# Altium schematic sheet Sheet_1_2023-10-08.schdoc
size 953 x 742 mm
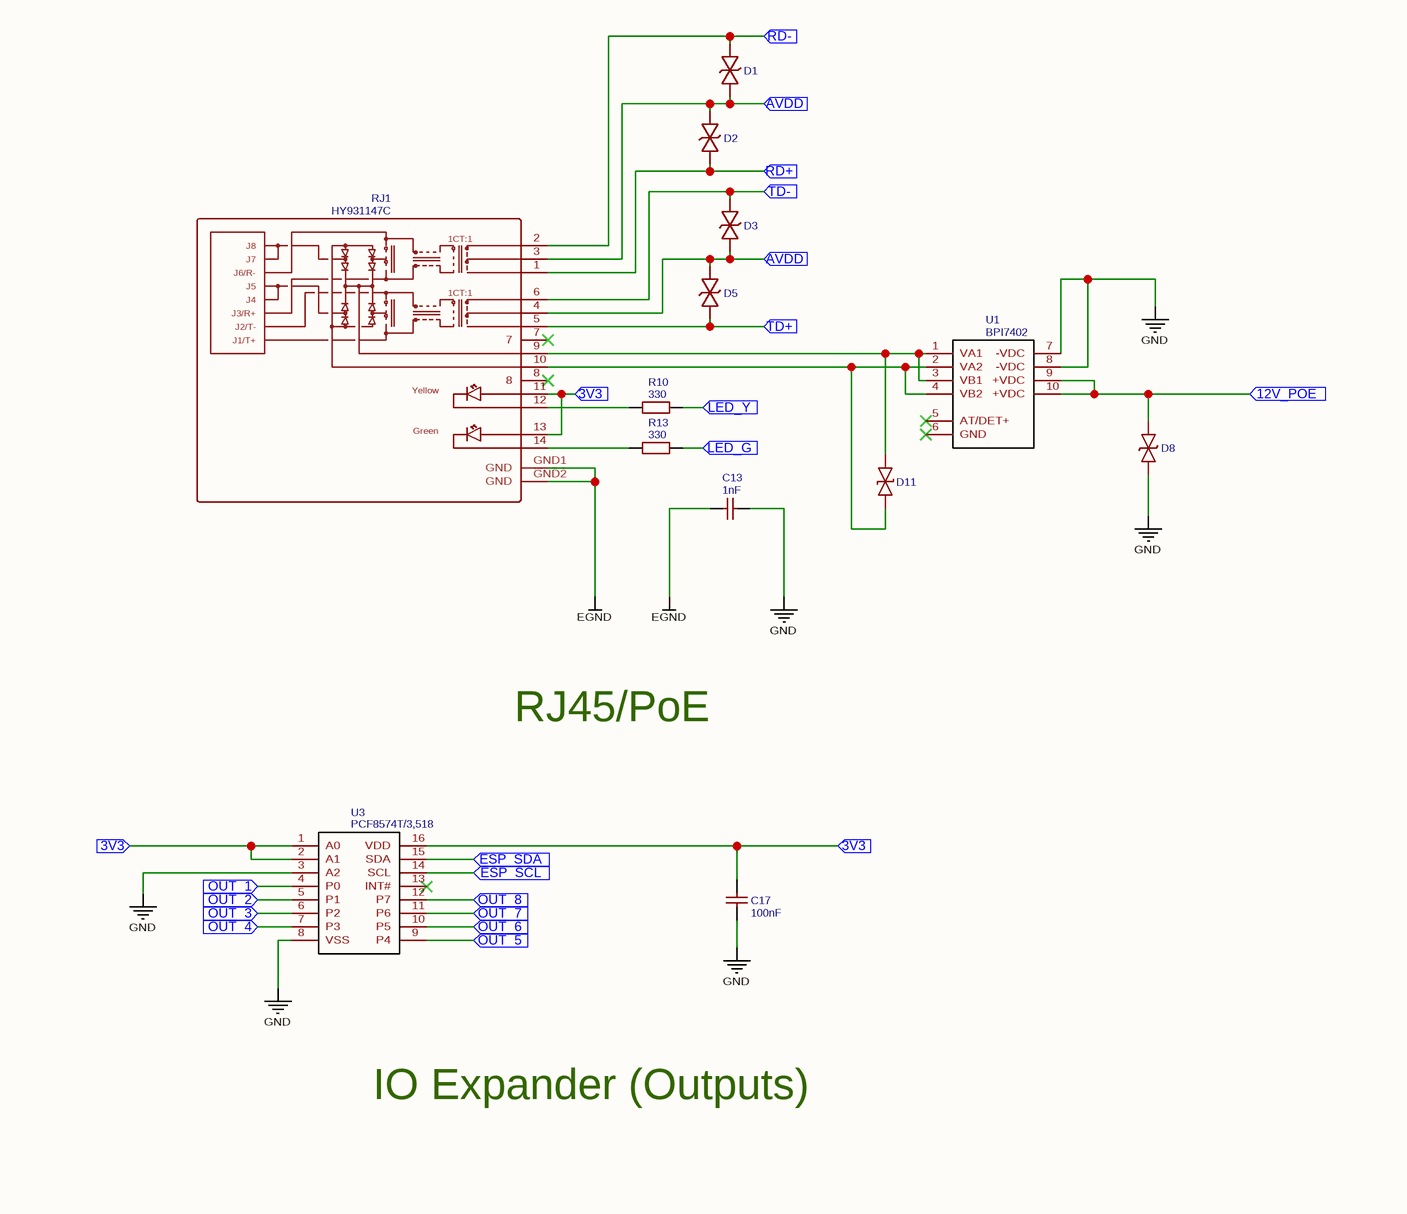
[diagram p0: Sheet_1_2023-10-08.schdoc, top left]
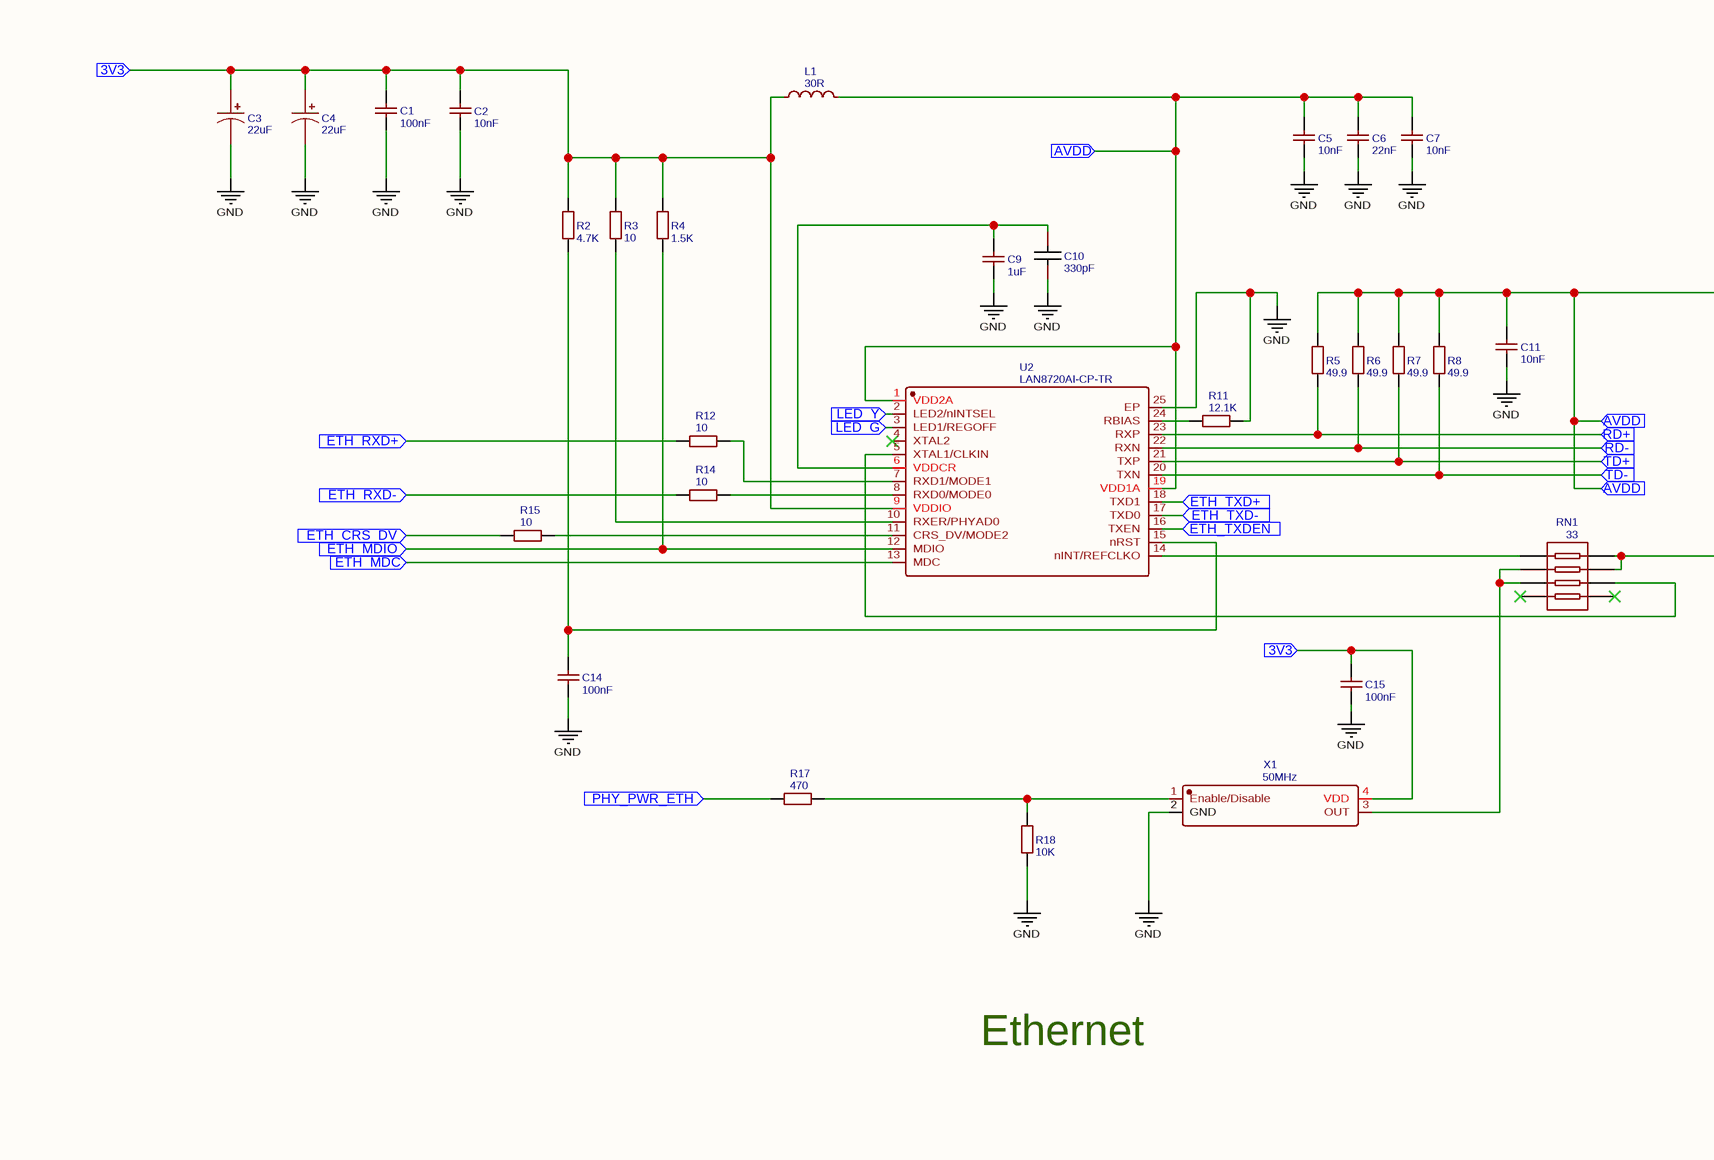
[diagram p1: Sheet_1_2023-10-08.schdoc, top middle]
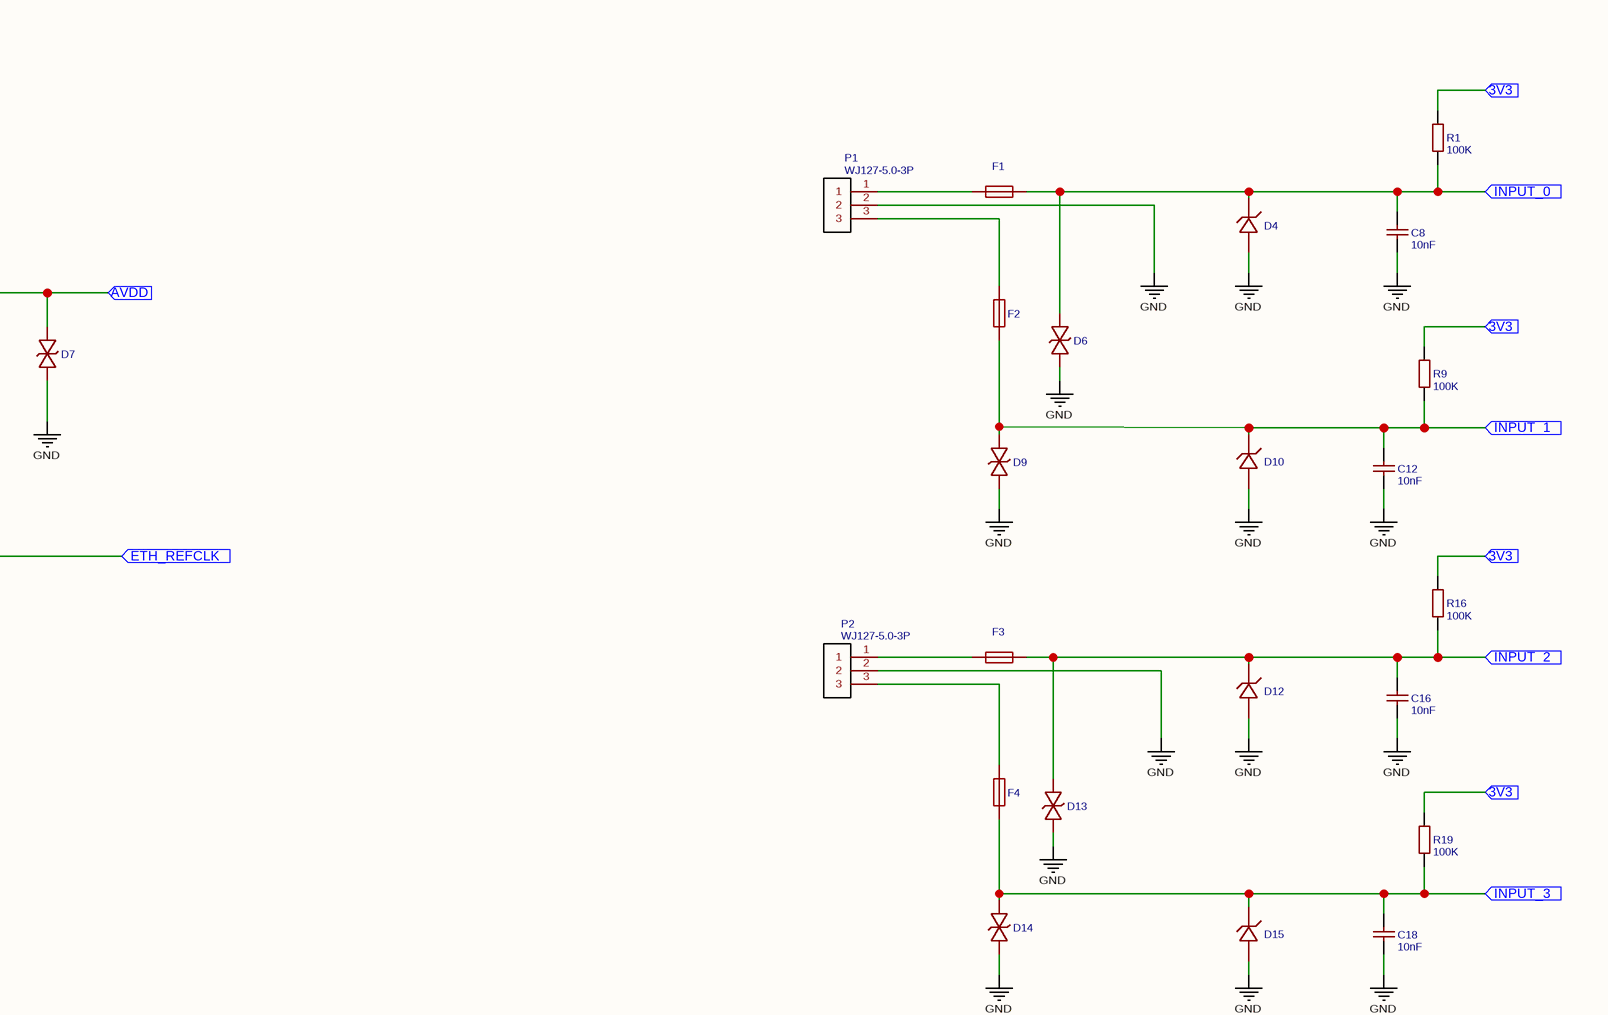
[diagram p2: Sheet_1_2023-10-08.schdoc, top right]
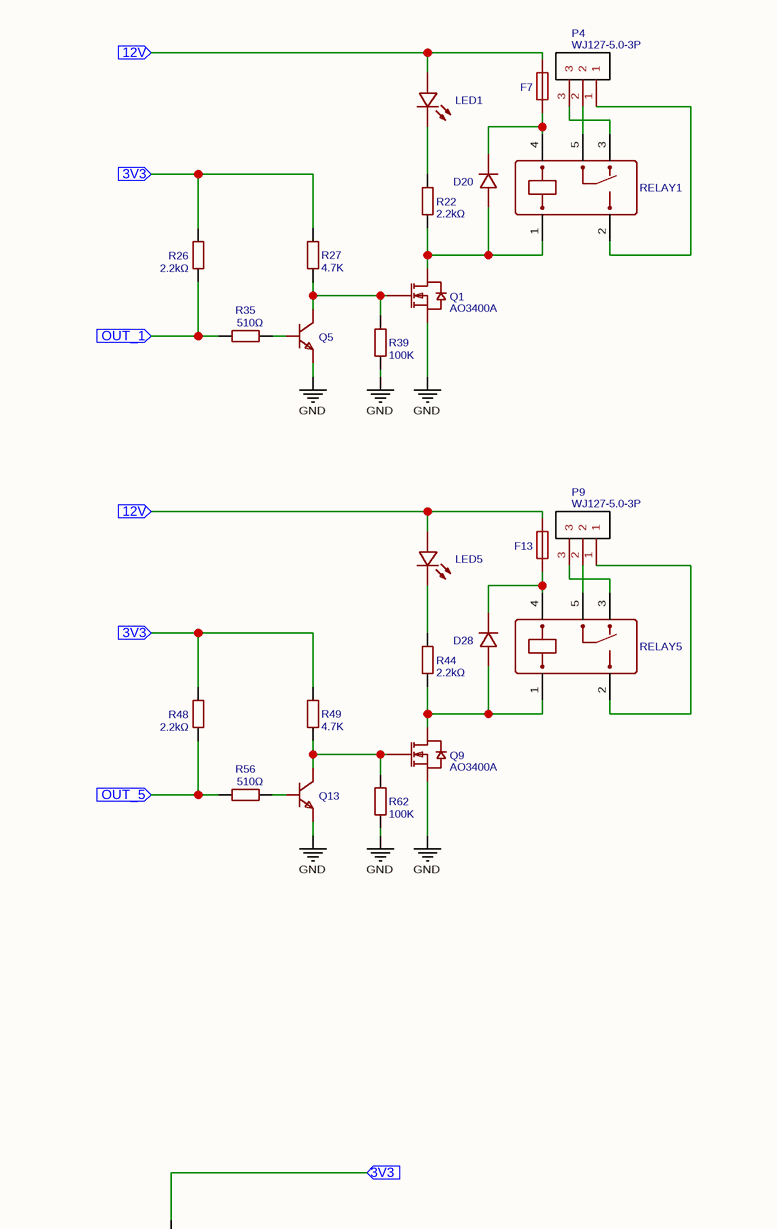
[diagram p3: Sheet_1_2023-10-08.schdoc, centre left]
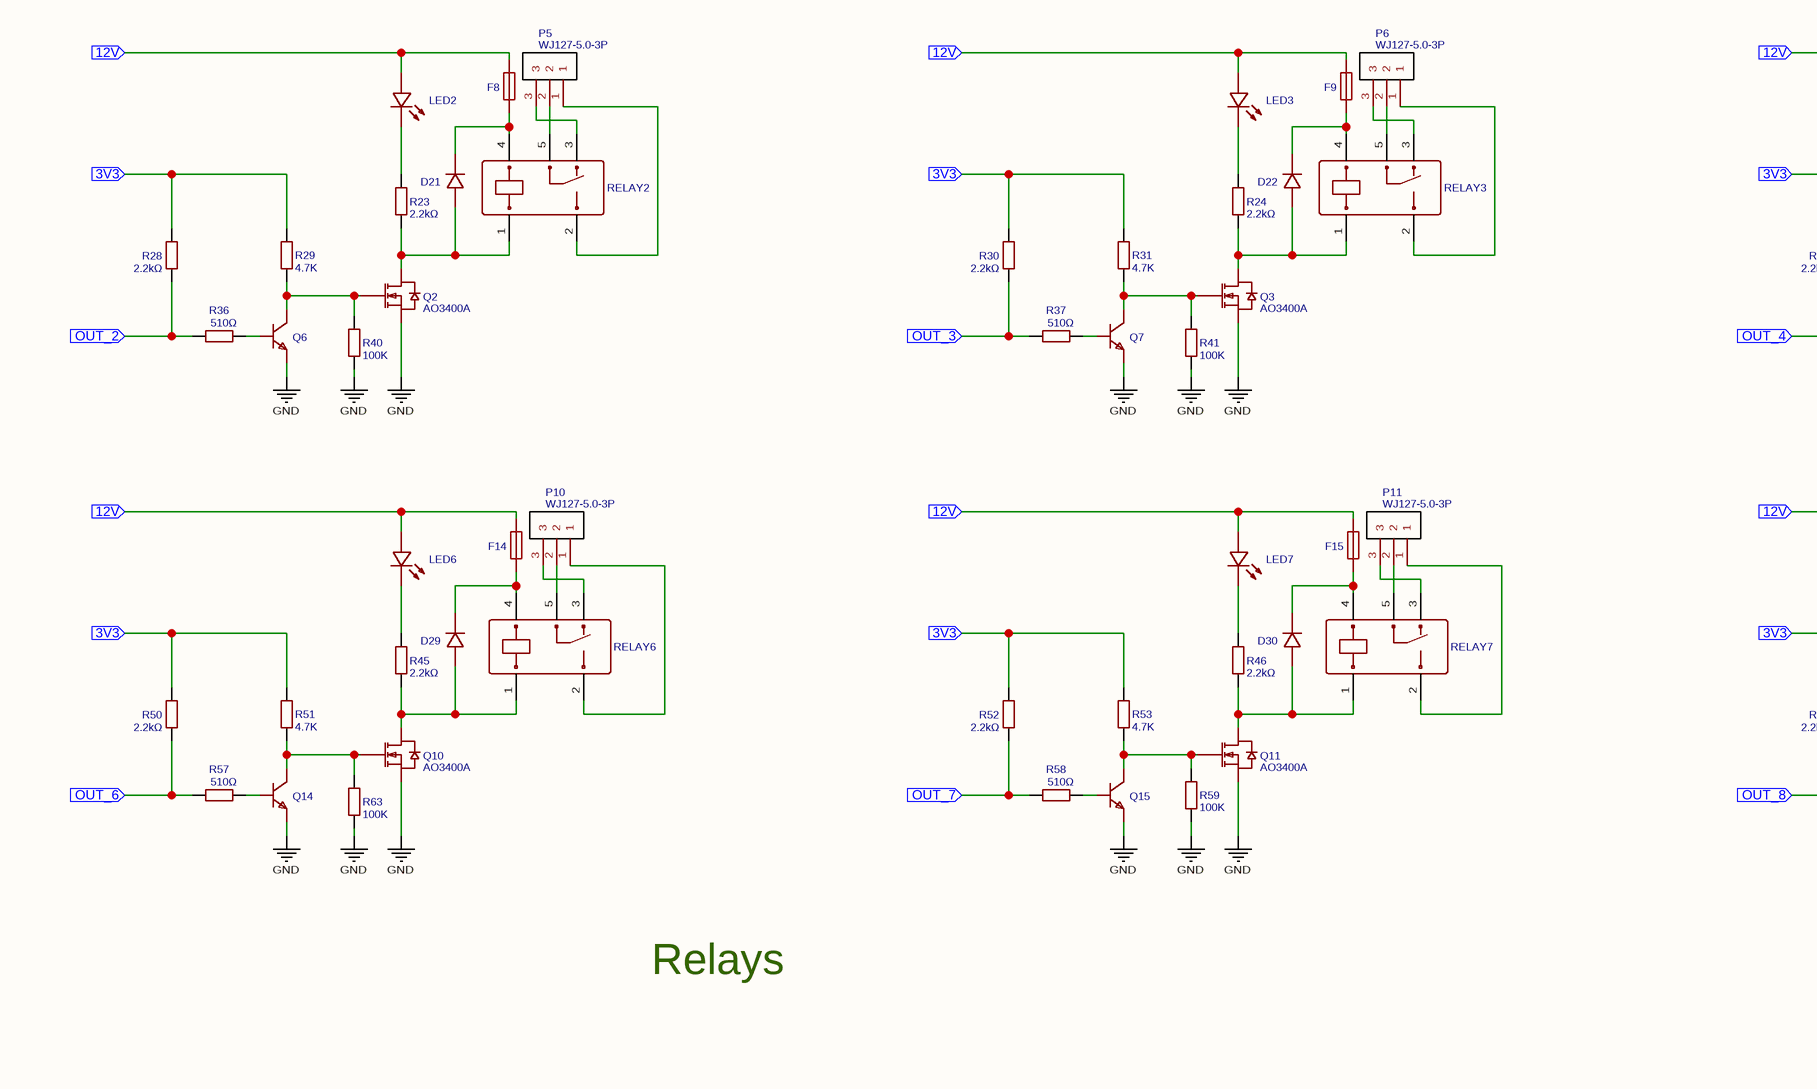
[diagram p4: Sheet_1_2023-10-08.schdoc, centre middle]
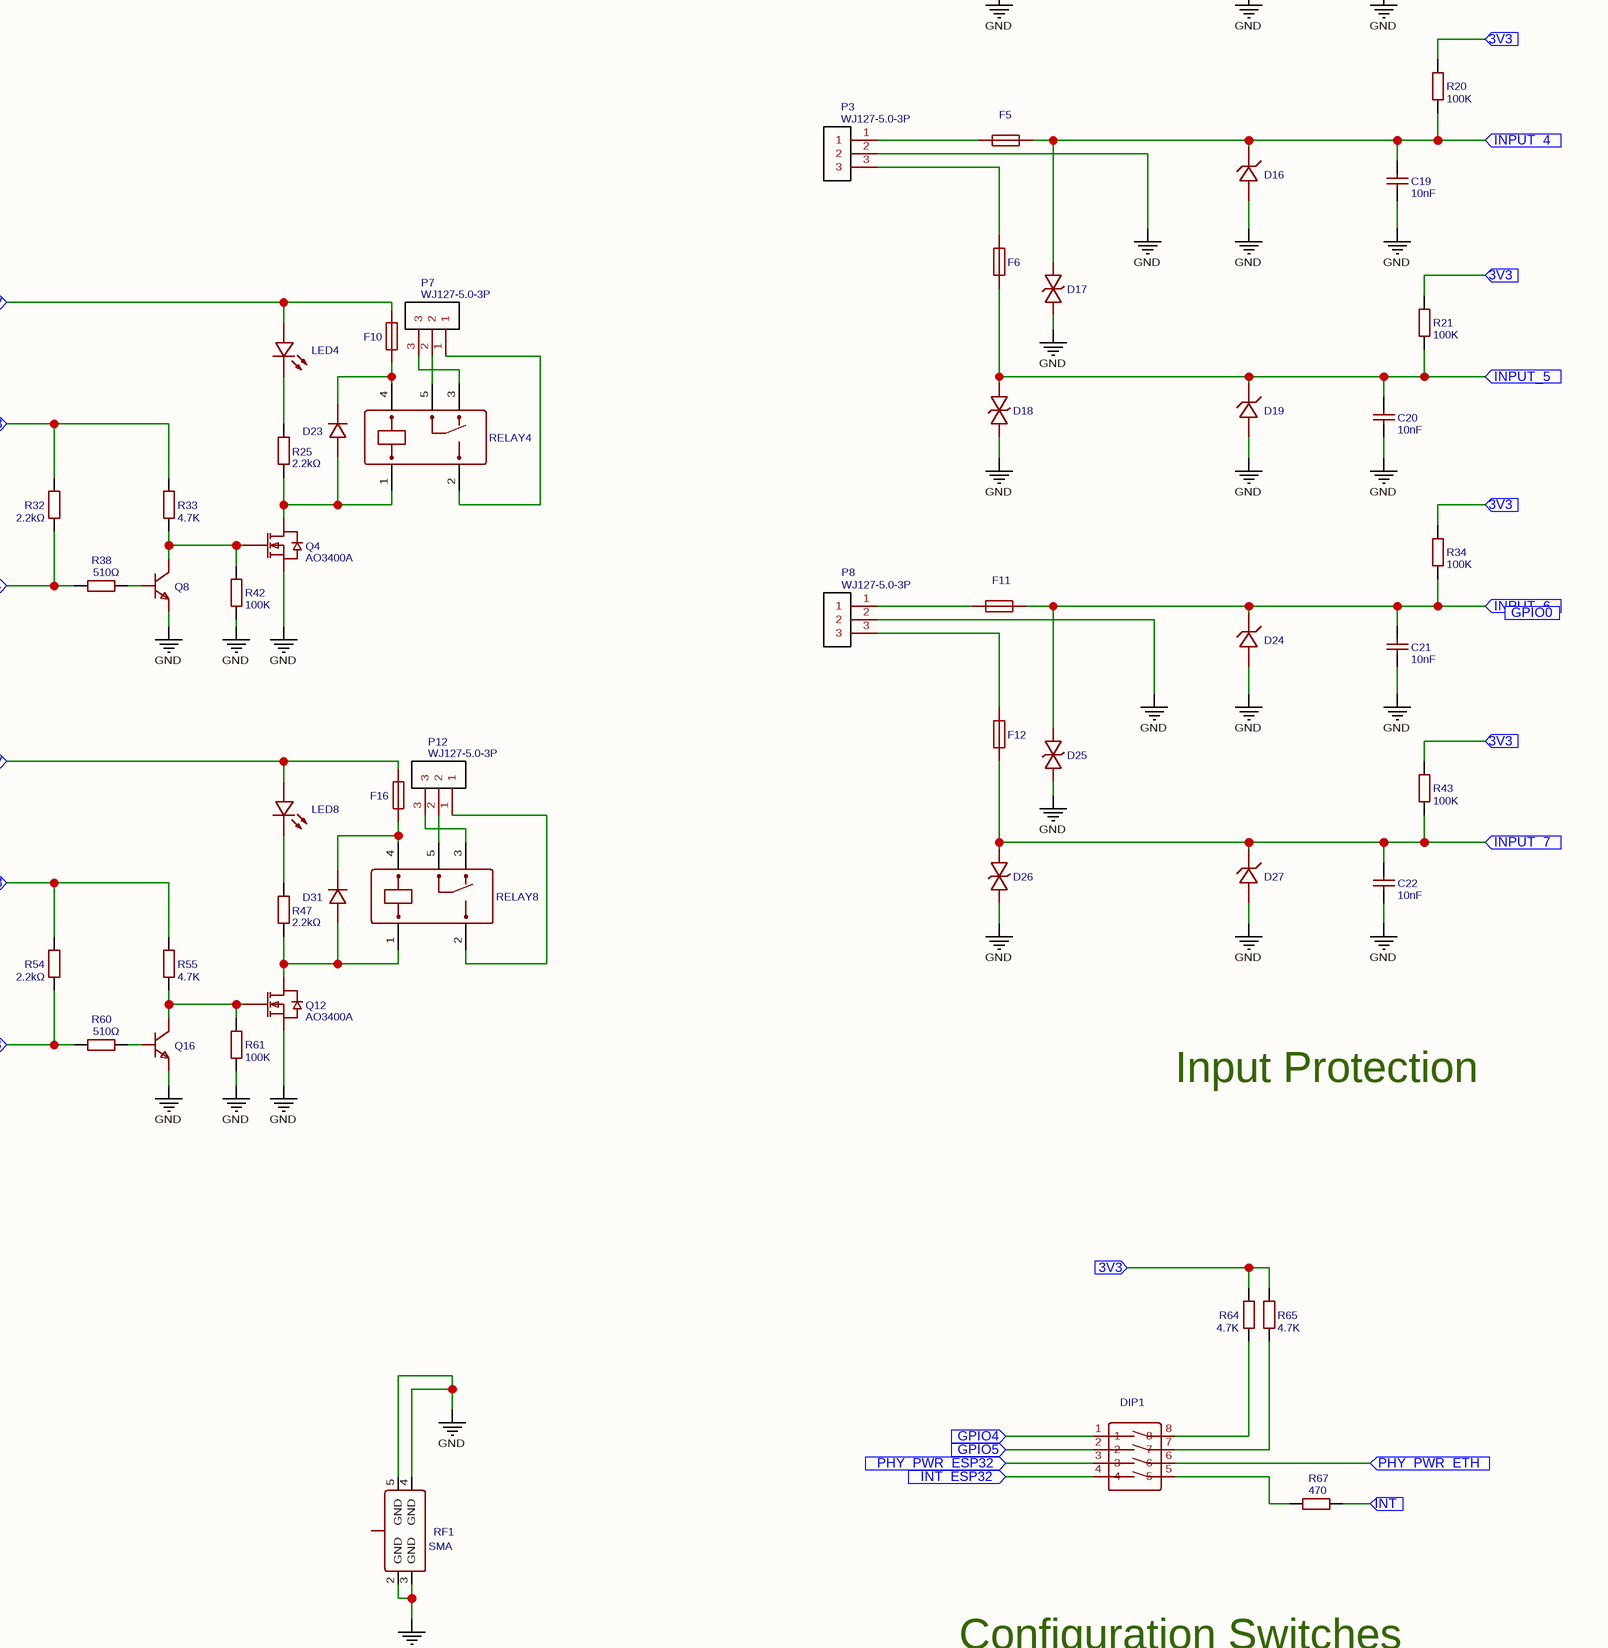
[diagram p5: Sheet_1_2023-10-08.schdoc, centre right]
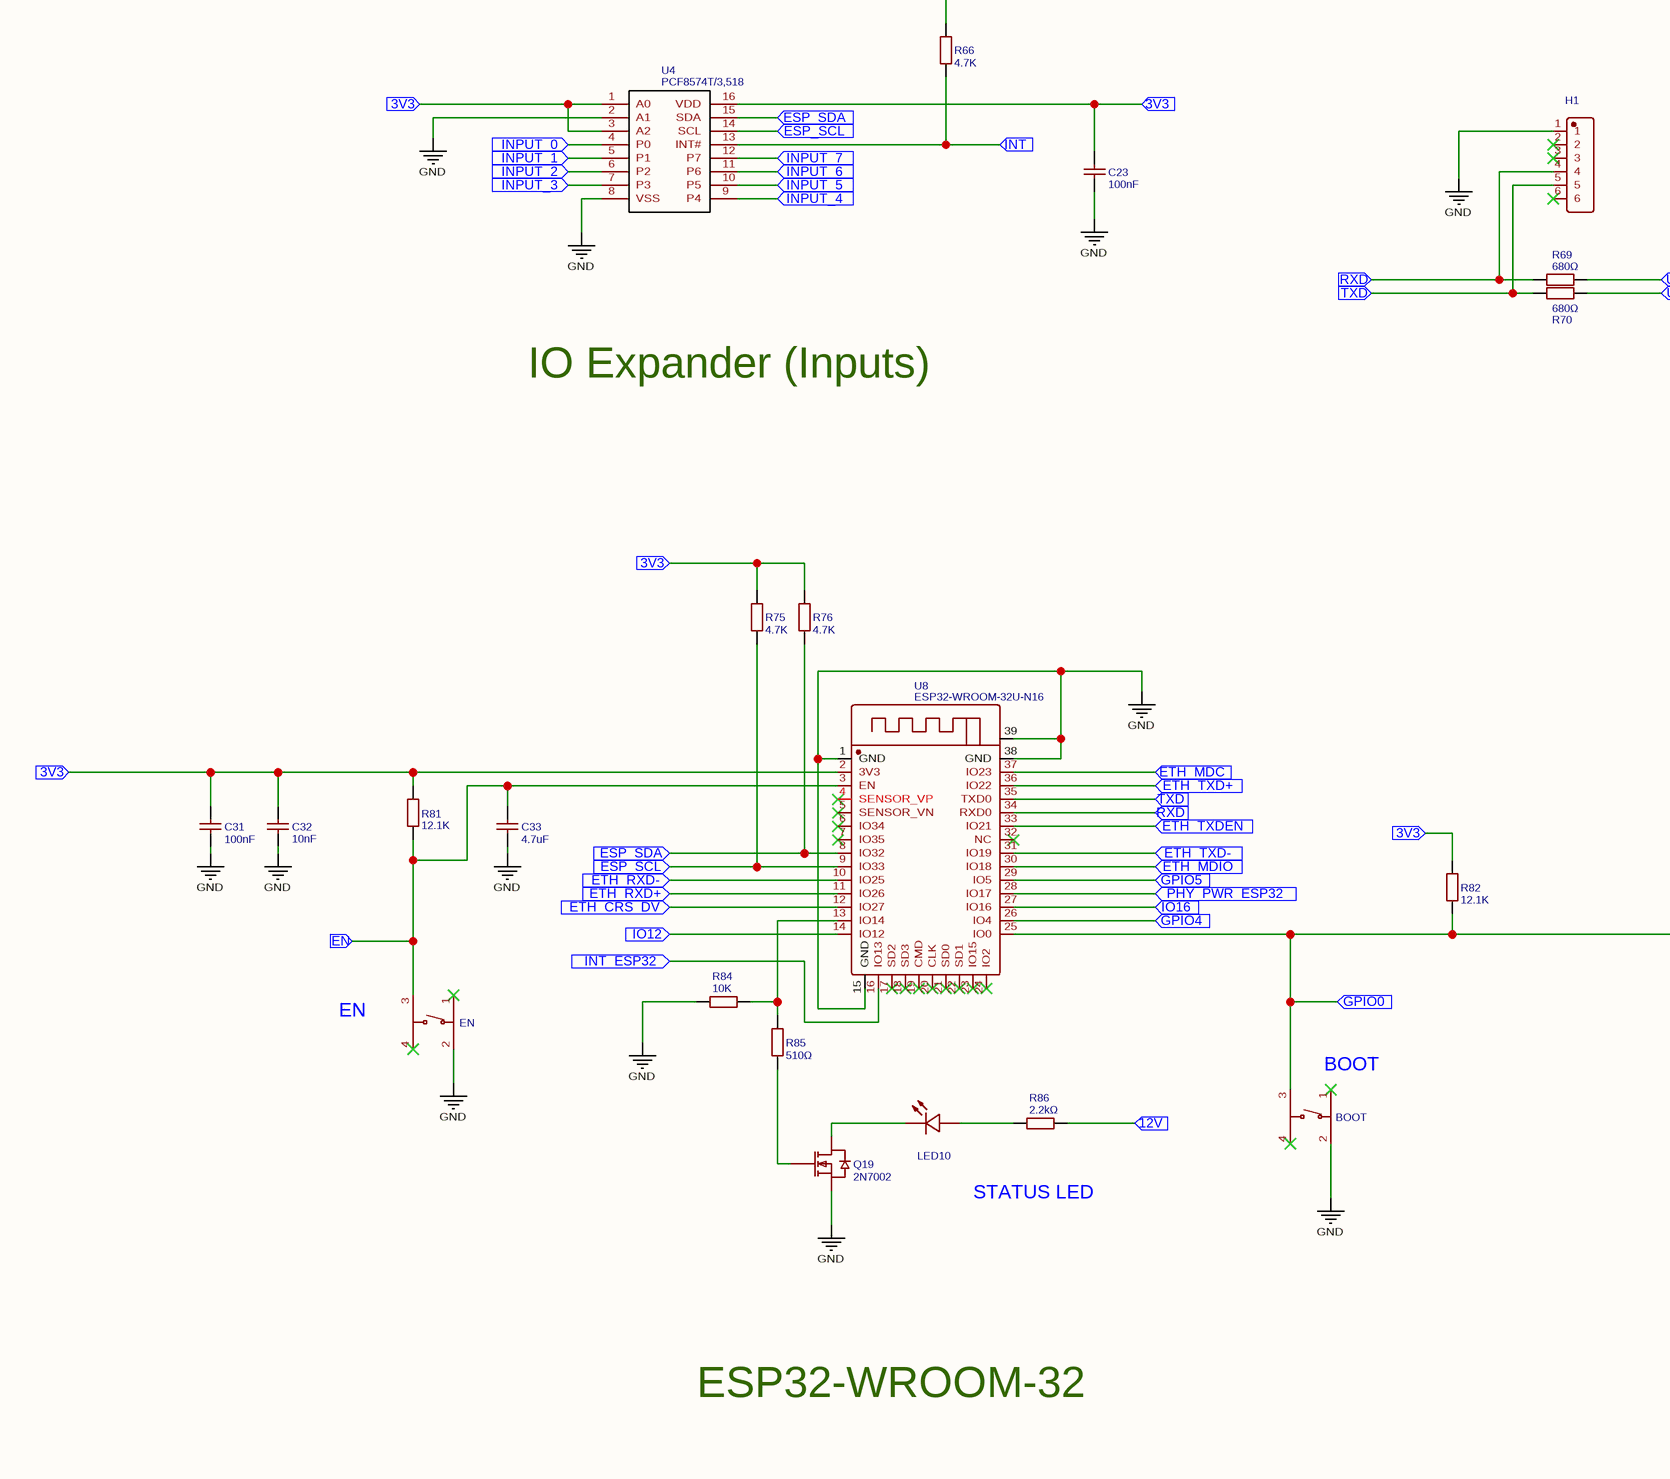
[diagram p6: Sheet_1_2023-10-08.schdoc, bottom left]
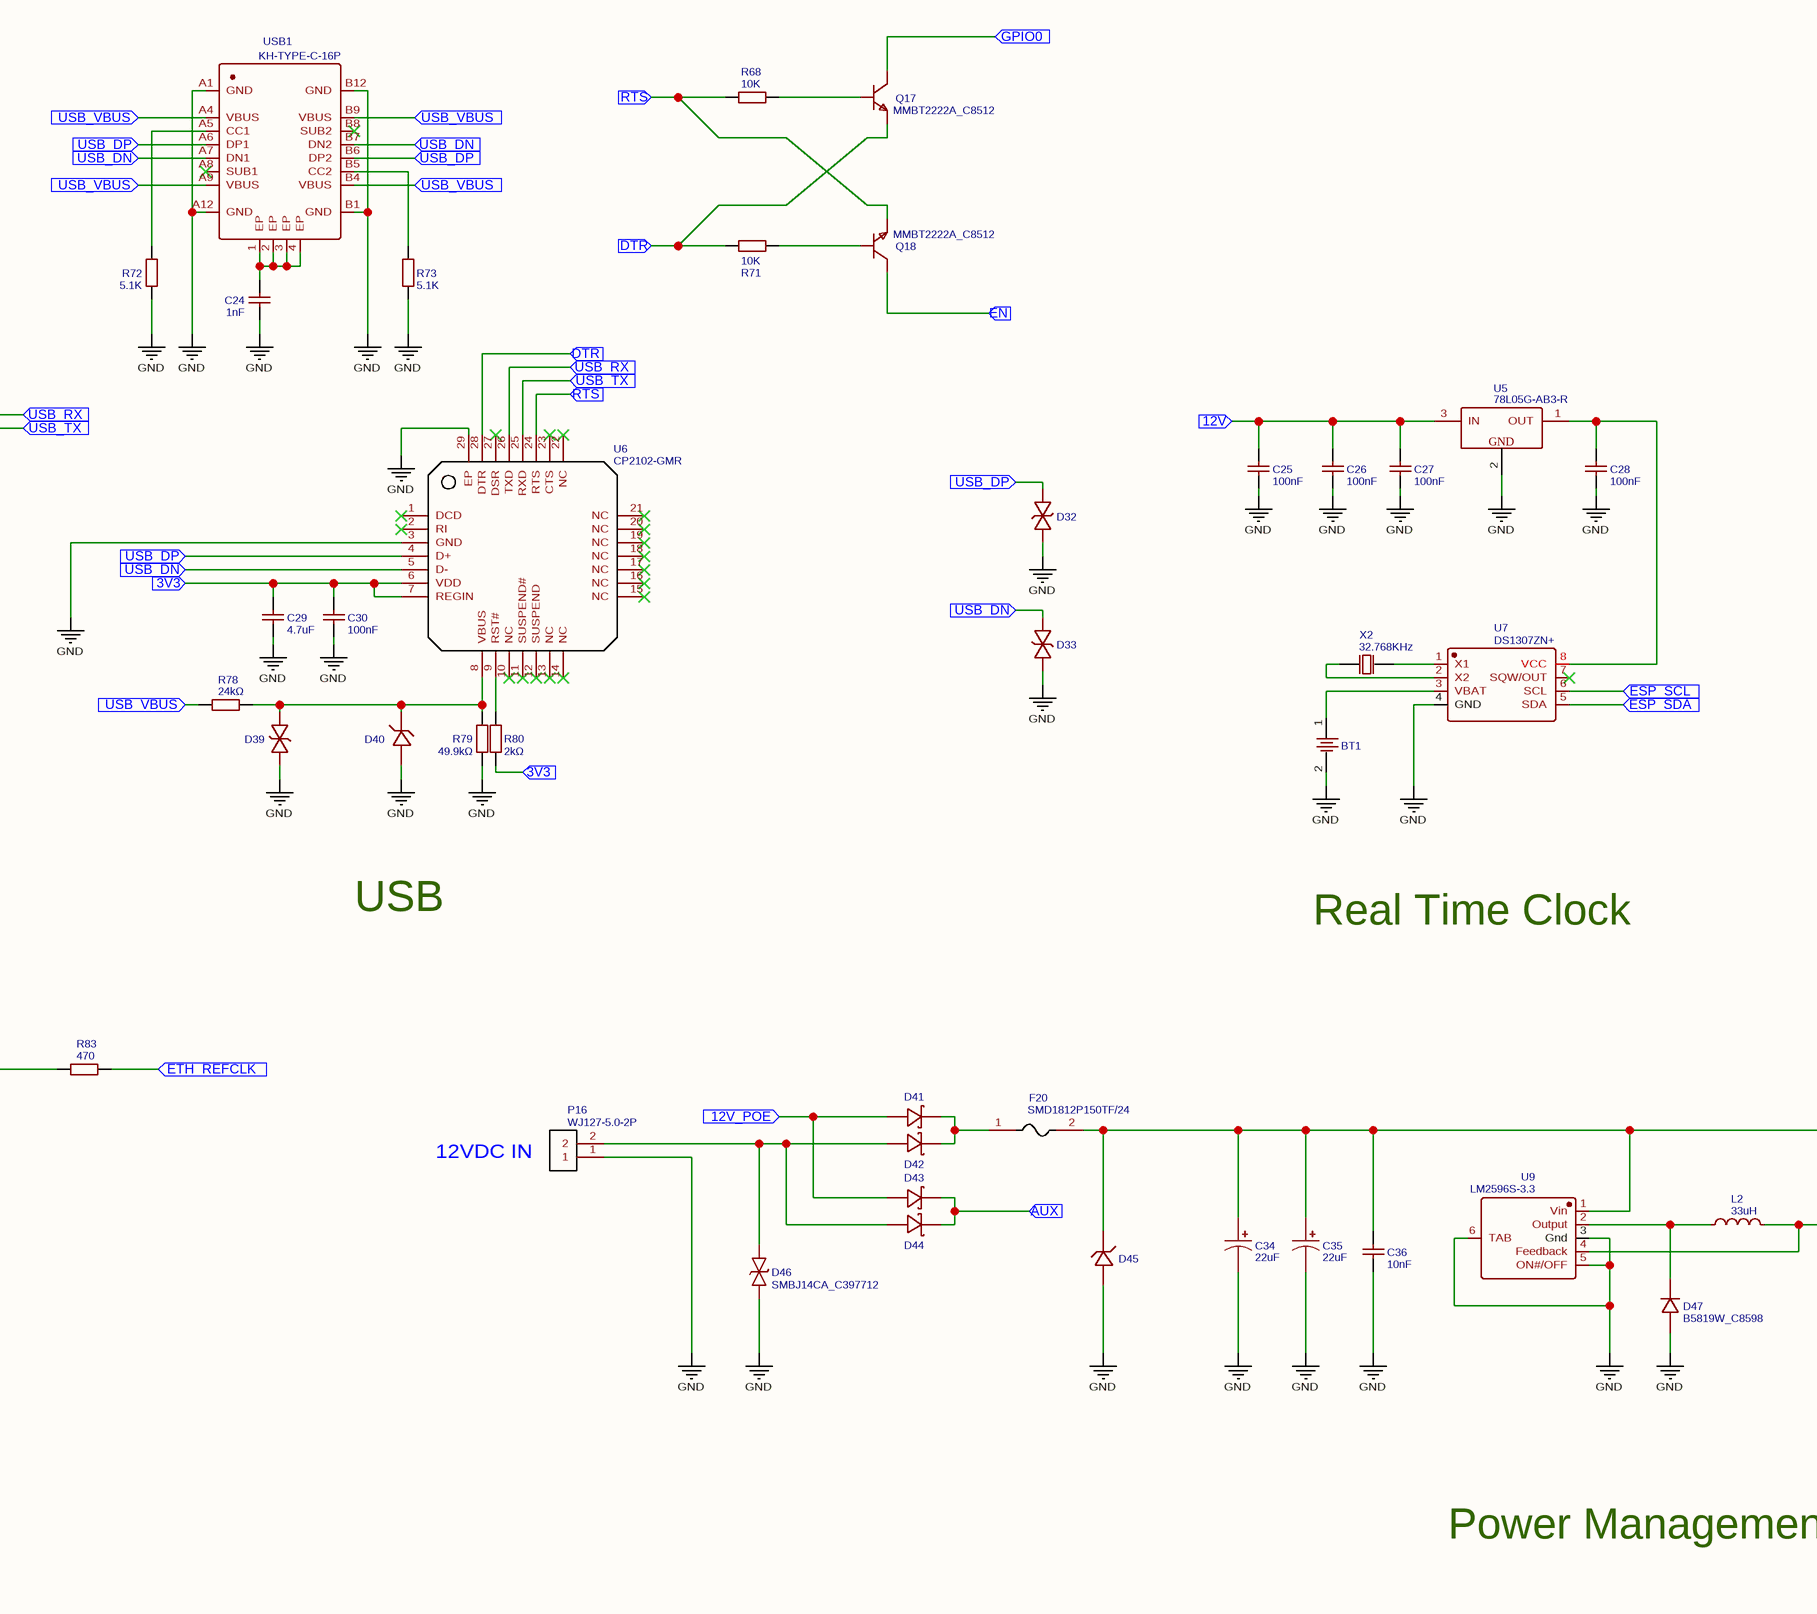
[diagram p7: Sheet_1_2023-10-08.schdoc, bottom middle]
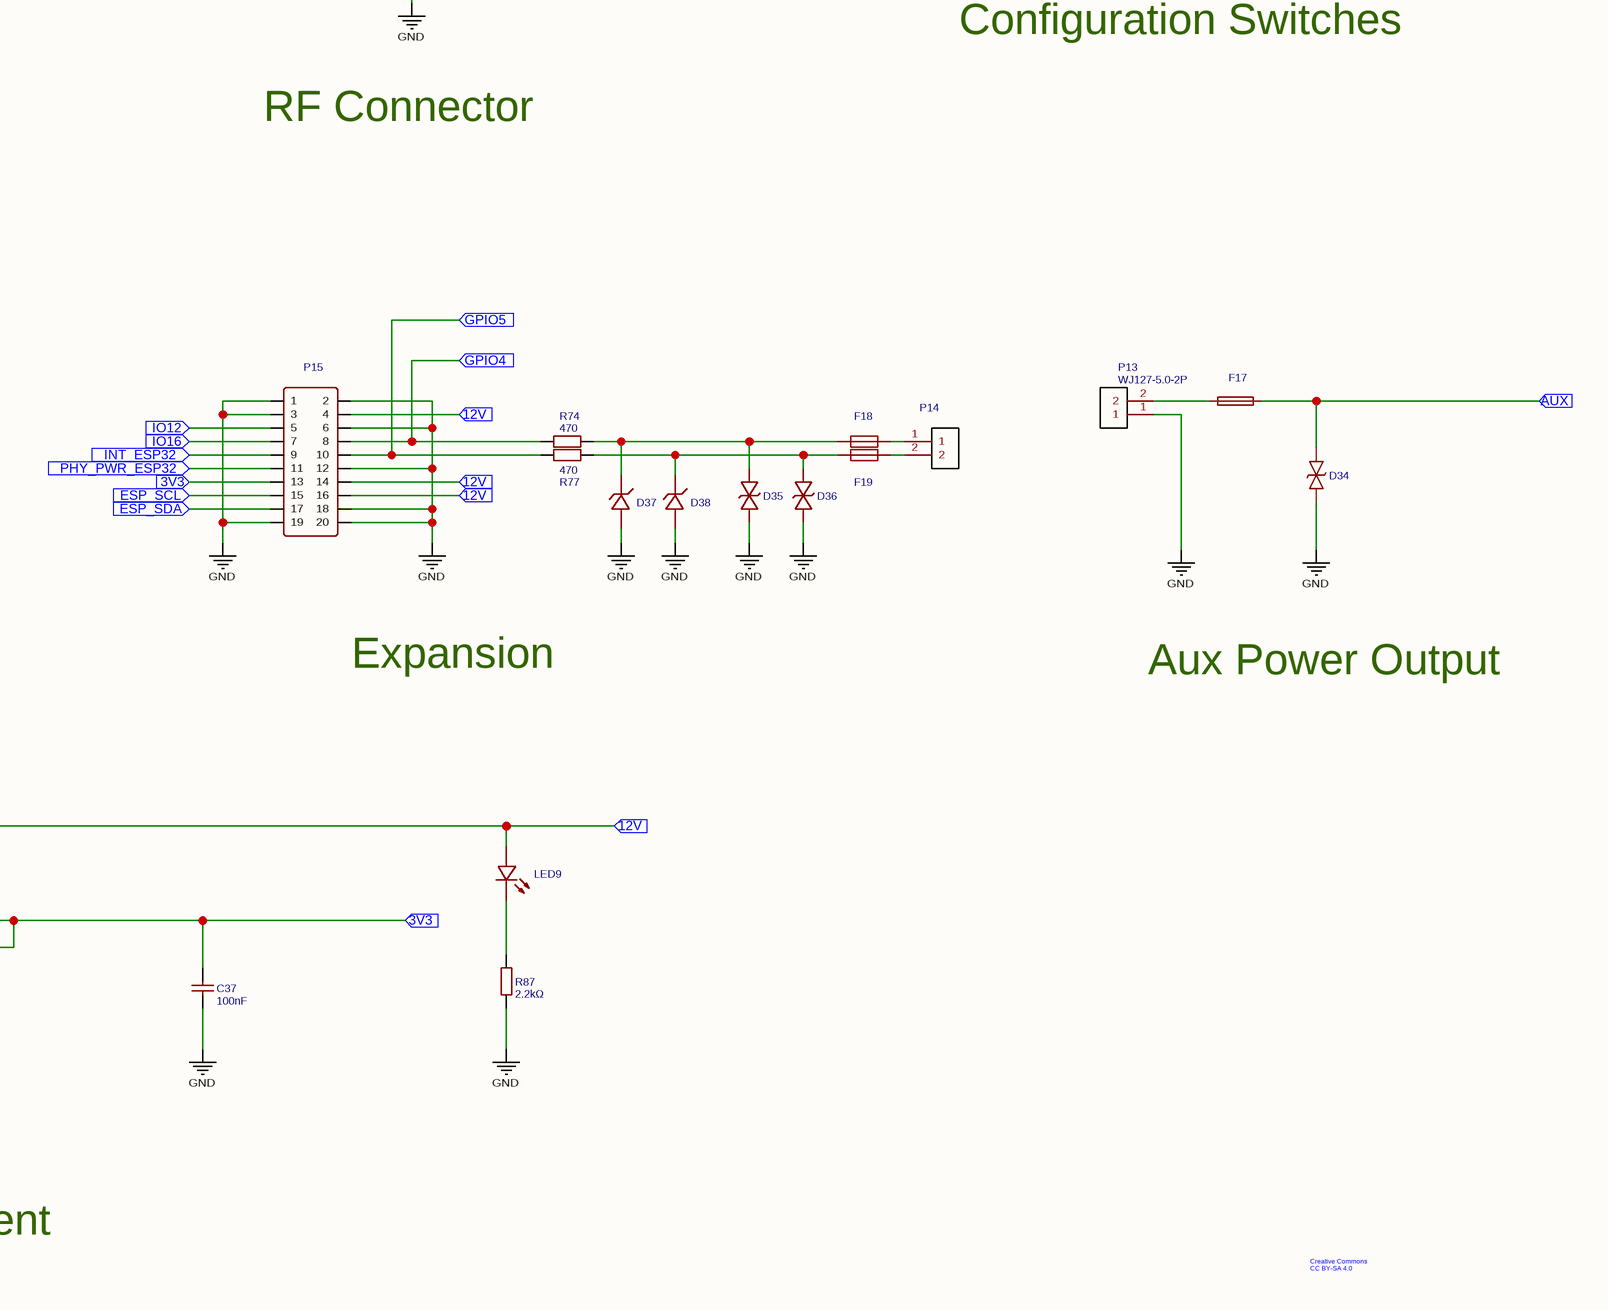
[diagram p8: Sheet_1_2023-10-08.schdoc, bottom right]

## Parts
BOOT  TS-1187A-B-A-B  [SW-SMD_4P-L5.1-W5.1-P3.70-LS6.5-TL-2]  (value not drawn)
BT1  BS-12-A1AJ002-F  [BAT-TH_BS-12-A1AJ002-F]  (value not drawn)
C1  100nF  [C0402_NEW]
C2  10nF  [C0402]
C3  22uF  [CAP-TH_BD5.0-P2.00-D0.8-FD]
C4  22uF  [CAP-TH_BD5.0-P2.00-D0.8-FD]
C5  10nF  [C0402]
C6  22nF  [C0402]
C7  10nF  [C0402]
C8  10nF  [C0402]
C9  1uF  [C0603]
C10  330pF  [C0402]
C11  10nF  [C0402]
C12  10nF  [C0402]
C13  1nF  [C1206]
C14  100nF  [C0402_NEW]
C15  100nF  [C0402_NEW]
C16  10nF  [C0402]
C17  100nF  [C0402_NEW]
C18  10nF  [C0402]
C19  10nF  [C0402]
C20  10nF  [C0402]
C21  10nF  [C0402]
C22  10nF  [C0402]
C23  100nF  [C0402_NEW]
C24  1nF  [C1206]
C25  100nF  [C0402_NEW]
C26  100nF  [C0402_NEW]
C27  100nF  [C0402_NEW]
C28  100nF  [C0402_NEW]
C29  4.7uF  [C1206]
C30  100nF  [C0402_NEW]
C31  100nF  [C0402_NEW]
C32  10nF  [C0402]
C33  4.7uF  [C1206]
C34  22uF  [CAP-TH_BD5.0-P2.00-D0.8-FD]
C35  22uF  [CAP-TH_BD5.0-P2.00-D0.8-FD]
C36  10nF  [C0805]
C37  100nF  [C0402_NEW]
D1  PESD03V32D-LC  [SOD-323_L1.7-W1.3-LS2.5-BI]  (value not drawn)
D2  PESD03V32D-LC  [SOD-323_L1.7-W1.3-LS2.5-BI]  (value not drawn)
D3  PESD03V32D-LC  [SOD-323_L1.7-W1.3-LS2.5-BI]  (value not drawn)
D4  ZMM3V3  [LL-34_L3.5-W1.5-RD]  (value not drawn)
D5  PESD03V32D-LC  [SOD-323_L1.7-W1.3-LS2.5-BI]  (value not drawn)
D6  PESD03V32D-LC  [SOD-323_L1.7-W1.3-LS2.5-BI]  (value not drawn)
D7  PESD03V32D-LC  [SOD-323_L1.7-W1.3-LS2.5-BI]  (value not drawn)
D8  SMBJ14CA_C397712  [SMB_L4.4-W3.6-LS5.4-BI]  (value not drawn)
D9  PESD03V32D-LC  [SOD-323_L1.7-W1.3-LS2.5-BI]  (value not drawn)
D10  ZMM3V3  [LL-34_L3.5-W1.5-RD]  (value not drawn)
D11  SMBJ64CA  [SMB_L4.6-W3.6-LS5.3-BI]  (value not drawn)
D12  ZMM3V3  [LL-34_L3.5-W1.5-RD]  (value not drawn)
D13  PESD03V32D-LC  [SOD-323_L1.7-W1.3-LS2.5-BI]  (value not drawn)
D14  PESD03V32D-LC  [SOD-323_L1.7-W1.3-LS2.5-BI]  (value not drawn)
D15  ZMM3V3  [LL-34_L3.5-W1.5-RD]  (value not drawn)
D16  ZMM3V3  [LL-34_L3.5-W1.5-RD]  (value not drawn)
D17  PESD03V32D-LC  [SOD-323_L1.7-W1.3-LS2.5-BI]  (value not drawn)
D18  PESD03V32D-LC  [SOD-323_L1.7-W1.3-LS2.5-BI]  (value not drawn)
D19  ZMM3V3  [LL-34_L3.5-W1.5-RD]  (value not drawn)
D20  B5819W_C8598  [SOD-123_L2.8-W1.8-LS3.7-RD]  (value not drawn)
D21  B5819W_C8598  [SOD-123_L2.8-W1.8-LS3.7-RD]  (value not drawn)
D22  B5819W_C8598  [SOD-123_L2.8-W1.8-LS3.7-RD]  (value not drawn)
D23  B5819W_C8598  [SOD-123_L2.8-W1.8-LS3.7-RD]  (value not drawn)
D24  ZMM3V3  [LL-34_L3.5-W1.5-RD]  (value not drawn)
D25  PESD03V32D-LC  [SOD-323_L1.7-W1.3-LS2.5-BI]  (value not drawn)
D26  PESD03V32D-LC  [SOD-323_L1.7-W1.3-LS2.5-BI]  (value not drawn)
D27  ZMM3V3  [LL-34_L3.5-W1.5-RD]  (value not drawn)
D28  B5819W_C8598  [SOD-123_L2.8-W1.8-LS3.7-RD]  (value not drawn)
D29  B5819W_C8598  [SOD-123_L2.8-W1.8-LS3.7-RD]  (value not drawn)
D30  B5819W_C8598  [SOD-123_L2.8-W1.8-LS3.7-RD]  (value not drawn)
D31  B5819W_C8598  [SOD-123_L2.8-W1.8-LS3.7-RD]  (value not drawn)
D32  PESD03V32D-LC  [SOD-323_L1.7-W1.3-LS2.5-BI]  (value not drawn)
D33  PESD03V32D-LC  [SOD-323_L1.7-W1.3-LS2.5-BI]  (value not drawn)
D34  SMBJ14CA_C397712  [SMB_L4.4-W3.6-LS5.4-BI]  (value not drawn)
D35  PESD03V32D-LC  [SOD-323_L1.7-W1.3-LS2.5-BI]  (value not drawn)
D36  PESD03V32D-LC  [SOD-323_L1.7-W1.3-LS2.5-BI]  (value not drawn)
D37  ZMM3V3  [LL-34_L3.5-W1.5-RD]  (value not drawn)
D38  ZMM3V3  [LL-34_L3.5-W1.5-RD]  (value not drawn)
D39  PESD03V32D-LC  [SOD-323_L1.7-W1.3-LS2.5-BI]  (value not drawn)
D40  ZMM3V3  [LL-34_L3.5-W1.5-RD]  (value not drawn)
D41  SS34_C8678  [DO-214AC_L4.3-W2.7-LS5.3-RD]  (value not drawn)
D42  SS34_C8678  [DO-214AC_L4.3-W2.7-LS5.3-RD]  (value not drawn)
D43  SS34_C8678  [DO-214AC_L4.3-W2.7-LS5.3-RD]  (value not drawn)
D44  SS34_C8678  [DO-214AC_L4.3-W2.7-LS5.3-RD]  (value not drawn)
D45  2EZ13D5_C388131  [DO-41_BD2.4-L4.7-P8.70-D0.9-RD]  (value not drawn)
D46  SMBJ14CA_C397712  [SMB_L4.4-W3.6-LS5.4-BI]
D47  B5819W_C8598  [SOD-123_L2.8-W1.8-LS3.7-RD]
DIP1  DSIC04LHGET  [SW-TH_DSIC04LHGET]  (value not drawn)
EN  TS-1187A-B-A-B  [SW-SMD_4P-L5.1-W5.1-P3.70-LS6.5-TL-2]  (value not drawn)
F1  BSMD0603-002-60V  [F0603]  (value not drawn)
F2  BSMD0603-002-60V  [F0603]  (value not drawn)
F3  BSMD0603-002-60V  [F0603]  (value not drawn)
F4  BSMD0603-002-60V  [F0603]  (value not drawn)
F5  BSMD0603-002-60V  [F0603]  (value not drawn)
F6  BSMD0603-002-60V  [F0603]  (value not drawn)
F7  BSMD0603-025-16V  [F0603]  (value not drawn)
F8  BSMD0603-025-16V  [F0603]  (value not drawn)
F9  BSMD0603-025-16V  [F0603]  (value not drawn)
F10  BSMD0603-025-16V  [F0603]  (value not drawn)
F11  BSMD0603-002-60V  [F0603]  (value not drawn)
F12  BSMD0603-002-60V  [F0603]  (value not drawn)
F13  BSMD0603-025-16V  [F0603]  (value not drawn)
F14  BSMD0603-025-16V  [F0603]  (value not drawn)
F15  BSMD0603-025-16V  [F0603]  (value not drawn)
F16  BSMD0603-025-16V  [F0603]  (value not drawn)
F17  ASMD2920-075  [F2920]  (value not drawn)
F18  BSMD0603-002-60V  [F0603]  (value not drawn)
F19  BSMD0603-002-60V  [F0603]  (value not drawn)
F20  SMD1812P150TF/24  [F1812]
H1  PZ254-1-06-Z-8.5  [HDR-TH_06P-P2.54-V-M]  (value not drawn)
L1  30R  [L0805]
L2  33uH  [IND-TH_BD9.0-P3.50-D0.6_VL0810]
LED1  0603White light_C2290  [LED0603-R-RD_WHITE]  (value not drawn)
LED2  0603White light_C2290  [LED0603-R-RD_WHITE]  (value not drawn)
LED3  0603White light_C2290  [LED0603-R-RD_WHITE]  (value not drawn)
LED4  0603White light_C2290  [LED0603-R-RD_WHITE]  (value not drawn)
LED5  0603White light_C2290  [LED0603-R-RD_WHITE]  (value not drawn)
LED6  0603White light_C2290  [LED0603-R-RD_WHITE]  (value not drawn)
LED7  0603White light_C2290  [LED0603-R-RD_WHITE]  (value not drawn)
LED8  0603White light_C2290  [LED0603-R-RD_WHITE]  (value not drawn)
LED9  0603White light_C2290  [LED0603-R-RD_WHITE]  (value not drawn)
LED10  0603White light_C2290  [LED0603-R-RD_WHITE]  (value not drawn)
P1  WJ127-5.0-3P  [CONN-TH_3P-P5.00_WJ127-5.0-3P]
P2  WJ127-5.0-3P  [CONN-TH_3P-P5.00_WJ127-5.0-3P]
P3  WJ127-5.0-3P  [CONN-TH_3P-P5.00_WJ127-5.0-3P]
P4  WJ127-5.0-3P  [CONN-TH_3P-P5.00_WJ127-5.0-3P]
P5  WJ127-5.0-3P  [CONN-TH_3P-P5.00_WJ127-5.0-3P]
P6  WJ127-5.0-3P  [CONN-TH_3P-P5.00_WJ127-5.0-3P]
P7  WJ127-5.0-3P  [CONN-TH_3P-P5.00_WJ127-5.0-3P]
P8  WJ127-5.0-3P  [CONN-TH_3P-P5.00_WJ127-5.0-3P]
P9  WJ127-5.0-3P  [CONN-TH_3P-P5.00_WJ127-5.0-3P]
P10  WJ127-5.0-3P  [CONN-TH_3P-P5.00_WJ127-5.0-3P]
P11  WJ127-5.0-3P  [CONN-TH_3P-P5.00_WJ127-5.0-3P]
P12  WJ127-5.0-3P  [CONN-TH_3P-P5.00_WJ127-5.0-3P]
P13  WJ127-5.0-2P  [CONN-TH_2P-P5.00_CPC3703CTR]
P14  WJ127-5.0-2P  [CONN-TH_2P-P5.00_CPC3703CTR]  (value not drawn)
P15  Header-Female-2.54_2x10  [HDR-TH_20P-P2.54-V-R2-C10-S2.54]  (value not drawn)
P16  WJ127-5.0-2P  [CONN-TH_2P-P5.00_CPC3703CTR]
Q1  AO3400A  [SOT-23-3_L2.9-W1.6-P1.90-LS2.8-BR]
Q2  AO3400A  [SOT-23-3_L2.9-W1.6-P1.90-LS2.8-BR]
Q3  AO3400A  [SOT-23-3_L2.9-W1.6-P1.90-LS2.8-BR]
Q4  AO3400A  [SOT-23-3_L2.9-W1.6-P1.90-LS2.8-BR]
Q5  2N3904  [SOT-23-3_L2.9-W1.3-P1.90-LS2.4-BR]  (value not drawn)
Q6  2N3904  [SOT-23-3_L2.9-W1.3-P1.90-LS2.4-BR]  (value not drawn)
Q7  2N3904  [SOT-23-3_L2.9-W1.3-P1.90-LS2.4-BR]  (value not drawn)
Q8  2N3904  [SOT-23-3_L2.9-W1.3-P1.90-LS2.4-BR]  (value not drawn)
Q9  AO3400A  [SOT-23-3_L2.9-W1.6-P1.90-LS2.8-BR]
Q10  AO3400A  [SOT-23-3_L2.9-W1.6-P1.90-LS2.8-BR]
Q11  AO3400A  [SOT-23-3_L2.9-W1.6-P1.90-LS2.8-BR]
Q12  AO3400A  [SOT-23-3_L2.9-W1.6-P1.90-LS2.8-BR]
Q13  2N3904  [SOT-23-3_L2.9-W1.3-P1.90-LS2.4-BR]  (value not drawn)
Q14  2N3904  [SOT-23-3_L2.9-W1.3-P1.90-LS2.4-BR]  (value not drawn)
Q15  2N3904  [SOT-23-3_L2.9-W1.3-P1.90-LS2.4-BR]  (value not drawn)
Q16  2N3904  [SOT-23-3_L2.9-W1.3-P1.90-LS2.4-BR]  (value not drawn)
Q17  MMBT2222A_C8512  [SOT-23-3_L2.9-W1.3-P1.90-LS2.4-BR]
Q18  MMBT2222A_C8512  [SOT-23-3_L2.9-W1.3-P1.90-LS2.4-BR]
Q19  2N7002  [SOT-23-3_L2.9-W1.3-P1.90-LS2.4-BR]
R1  100K  [R0402]
R2  4.7K  [R0402]
R3  10  [R0402]
R4  1.5K  [R0402]
R5  49.9  [R0402]
R6  49.9  [R0402]
R7  49.9  [R0402]
R8  49.9  [R0402]
R9  100K  [R0402]
R10  330  [R0402]
R11  12.1K  [R0402]
R12  10  [R0402]
R13  330  [R0402]
R14  10  [R0402]
R15  10  [R0402]
R16  100K  [R0402]
R17  470  [R0402]
R18  10K  [R0402]
R19  100K  [R0402]
R20  100K  [R0402]
R21  100K  [R0402]
R22  2.2kΩ  [R0603]
R23  2.2kΩ  [R0603]
R24  2.2kΩ  [R0603]
R25  2.2kΩ  [R0603]
R26  2.2kΩ  [R0402]
R27  4.7K  [R0402]
R28  2.2kΩ  [R0402]
R29  4.7K  [R0402]
R30  2.2kΩ  [R0402]
R31  4.7K  [R0402]
R32  2.2kΩ  [R0402]
R33  4.7K  [R0402]
R34  100K  [R0402]
R35  510Ω  [R0402]
R36  510Ω  [R0402]
R37  510Ω  [R0402]
R38  510Ω  [R0402]
R39  100K  [R0402]
R40  100K  [R0402]
R41  100K  [R0402]
R42  100K  [R0402]
R43  100K  [R0402]
R44  2.2kΩ  [R0603]
R45  2.2kΩ  [R0603]
R46  2.2kΩ  [R0603]
R47  2.2kΩ  [R0603]
R48  2.2kΩ  [R0402]
R49  4.7K  [R0402]
R50  2.2kΩ  [R0402]
R51  4.7K  [R0402]
R52  2.2kΩ  [R0402]
R53  4.7K  [R0402]
R54  2.2kΩ  [R0402]
R55  4.7K  [R0402]
R56  510Ω  [R0402]
R57  510Ω  [R0402]
R58  510Ω  [R0402]
R59  100K  [R0402]
R60  510Ω  [R0402]
R61  100K  [R0402]
R62  100K  [R0402]
R63  100K  [R0402]
R64  4.7K  [R0402]
R65  4.7K  [R0402]
R66  4.7K  [R0402]
R67  470  [R0402]
R68  10K  [R0402]
R69  680Ω  [R0402]
R70  680Ω  [R0402]
R71  10K  [R0402]
R72  5.1K  [R0402]
R73  5.1K  [R0402]
R74  470  [R0402]
R75  4.7K  [R0402]
R76  4.7K  [R0402]
R77  470  [R0402]
R78  24kΩ  [R0402]
R79  49.9kΩ  [R0402]
R80  2kΩ  [R0402]
R81  12.1K  [R0402]
R82  12.1K  [R0402]
R83  470  [R0402]
R84  10K  [R0402]
R85  510Ω  [R0402]
R86  2.2kΩ  [R0603]
R87  2.2kΩ  [R0603]
RELAY1  SRD-12VDC-SL-C  [RELAY-TH_SRD-XXVDC-XL-C]  (value not drawn)
RELAY2  SRD-12VDC-SL-C  [RELAY-TH_SRD-XXVDC-XL-C]  (value not drawn)
RELAY3  SRD-12VDC-SL-C  [RELAY-TH_SRD-XXVDC-XL-C]  (value not drawn)
RELAY4  SRD-12VDC-SL-C  [RELAY-TH_SRD-XXVDC-XL-C]  (value not drawn)
RELAY5  SRD-12VDC-SL-C  [RELAY-TH_SRD-XXVDC-XL-C]  (value not drawn)
RELAY6  SRD-12VDC-SL-C  [RELAY-TH_SRD-XXVDC-XL-C]  (value not drawn)
RELAY7  SRD-12VDC-SL-C  [RELAY-TH_SRD-XXVDC-XL-C]  (value not drawn)
RELAY8  SRD-12VDC-SL-C  [RELAY-TH_SRD-XXVDC-XL-C]  (value not drawn)
RF1  SMA  [SMA-TH_HJ-SMA200]
RJ1  HY931147C  [RJ45-TH_HY931147C]
RN1  33  [RES-ARRAY-SMD_0402-8P-L2.0-W1.0-BL]
U1  BPI7402  [BPI7402]
U2  LAN8720AI-CP-TR  [QFN-24_L4.0-W4.0-P0.50-BL-EP2.6]
U3  PCF8574T/3,518  [SOIC-16_L10.3-W7.5-P1.27-LS10.3-BL]
U4  PCF8574T/3,518  [SOIC-16_L10.3-W7.5-P1.27-LS10.3-BL]
U5  78L05G-AB3-R  [SOT-89-3_L4.5-W2.5-P1.50-LS4.2-BR]
U6  CP2102-GMR  [WQFN-28_L5.0-W5.0-P0.50-BL-EP3.2]
U7  DS1307ZN+  [SOP-8_L4.9-W3.9-P1.27-LS6.0-BL]
U8  ESP32-WROOM-32U-N16  [WIFIM-SMD_38P-L19.2-W18.0-P1.27]
U9  LM2596S-3.3  [TO-263-5_L10.0-W8.4-P1.70-LS15.3-BR]
USB1  KH-TYPE-C-16P  [USB-C-SMD_KH-TYPE-C-16P]
X1  50MHz  [OSC-SMD_4P-L7.0-W5.0-BL]
X2  32.768KHz  [OSC-TH_BD3.1-P0.8-D0.3]

## Ports
3V3 (in), 12V (in), 12V_POE (in), AUX (in), AVDD (in), DTR (in), EN (in), ESP_SCL (in), ESP_SDA (in), ETH_CRS_DV (in), ETH_MDC (in), ETH_MDIO (in), ETH_REFCLK (in), ETH_RXD+ (in), ETH_RXD- (in), ETH_TXD+ (in), ETH_TXD- (in), ETH_TXDEN (in), GPIO0 (in), GPIO4 (in), GPIO5 (in), INPUT_0 (in), INPUT_1 (in), INPUT_2 (in), INPUT_3 (in), INPUT_4 (in), INPUT_5 (in), INPUT_6 (in), INPUT_7 (in), INT (in), INT_ESP32 (in), IO12 (in), IO16 (in), LED_G (in), LED_Y (in), OUT_1 (in), OUT_2 (in), OUT_3 (in), OUT_4 (in), OUT_5 (in), OUT_6 (in), OUT_7 (in), OUT_8 (in), PHY_PWR_ESP32 (in), PHY_PWR_ETH (in), RD+ (in), RD- (in), RTS (in), RXD (in), TD+ (in), TD- (in), TXD (in), USB_DN (in), USB_DP (in), USB_RX (in), USB_TX (in), USB_VBUS (in)

## Nets
EGND: C13.1 RJ1.GND1(GND) RJ1.GND2(GND)
GND: BOOT.2(B) BT1.2 C1.2 C2.2 C3.2 C4.2 C5.2 C6.2 C7.2 C8.2 C9.2 C10.2 C11.2 C12.2 C13.2 C14.2 C15.2 C16.2 C17.2 C18.2 C19.2 C20.2 C21.2 C22.2 C23.2 C24.2 C25.2 C26.2 C27.2 C28.2 C29.1 C30.2 C31.2 C32.2 C33.1 C34.2 C35.2 C36.2 C37.2 D4.2(A) D6.2 D7.2 D8.2 D9.2 D10.2(A) D12.2(A) D13.2 D14.2 D15.2(A) D16.2(A) D17.2 D18.2 D19.2(A) D24.2(A) D25.2 D26.2 D27.2(A) D32.1 D33.1 D34.2 D35.2 D36.2 D37.2(A) D38.2(A) D39.1 D40.2(A) D45.2(A) D46.2 D47.2(+) EN.2(B) H1.1 P1.2 P2.2 P3.2 P8.2 P13.1 P15.1 P15.2 P15.3 P15.6 P15.12 P15.18 P15.19 P15.20 P16.1 Q1.2(S) Q2.2(S) Q3.2(S) Q4.2(S) Q5.2(E) Q6.2(E) Q7.2(E) Q8.2(E) Q9.2(S) Q10.2(S) Q11.2(S) Q12.2(S) Q13.2(E) Q14.2(E) Q15.2(E) Q16.2(E) Q19.2(S) R11.2 R18.2 R39.2 R40.2 R41.2 R42.2 R59.2 R61.2 R62.2 R63.2 R72.2 R73.2 R79.2 R84.2 R87.2 RF1.2(GND) RF1.3(GND) RF1.4(GND) RF1.5(GND) U1.7(-VDC) U1.8(-VDC) U2.25(EP) U3.3(A2) U3.8(VSS) U4.2(A1) U4.8(VSS) U5.2(GND) U6.3(GND) U6.29(EP) U7.4(GND) U8.1(GND) U8.15(GND) U8.38(GND) U8.39(GND) U9.3(Gnd) U9.5(ON#/OFF) U9.6(TAB) USB1.A1(GND) USB1.A12(GND) USB1.B1(GND) USB1.B12(GND) X1.2(GND)
3V3: C1.1 C2.1 C3.1 C4.1 C15.1 C17.1 C23.1 C29.2 C30.1 C31.1 C32.1 C37.1 L1.1 L2.2 P15.13 R1.1 R2.1 R3.1 R4.1 R9.1 R16.1 R19.1 R20.1 R21.1 R26.1 R27.1 R28.1 R29.1 R30.1 R31.1 R32.1 R33.1 R34.1 R43.1 R48.1 R49.1 R50.1 R51.1 R52.1 R53.1 R54.1 R55.1 R64.1 R65.1 R66.1 R75.1 R76.1 R80.2 R81.1 R82.1 RJ1.11 RJ1.13 U2.9(VDDIO) U3.1(A0) U3.2(A1) U3.16(VDD) U4.1(A0) U4.3(A2) U4.16(VDD) U6.6(VDD) U6.7(REGIN) U8.2(3V3) U9.4(Feedback) X1.4(VDD) ; port 3V3
12V: C25.1 C26.1 C27.1 C34.1 C35.1 C36.1 D45.1(C) F7.1 F8.1 F9.1 F10.1 F13.1 F14.1 F15.1 F16.1 F20.2 LED1.1(A) LED2.1(A) LED3.1(A) LED4.1(A) LED5.1(A) LED6.1(A) LED7.1(A) LED8.1(A) LED9.1(A) P15.4 P15.14 P15.16 R86.1 U5.3(IN) U9.1(Vin) ; port 12V
12V_POE: D8.1 D41.2(A) D43.2(A) U1.9(+VDC) U1.10(+VDC) ; port 12V_POE
AUX: D34.1 D43.1(K) D44.1(K) F17.2 ; port AUX
AVDD: C5.1 C6.1 C7.1 C11.1 D1.2 D2.1 D3.2 D5.1 D7.1 L1.2 R5.1 R6.1 R7.1 R8.1 RJ1.3 RJ1.4 U2.1(VDD2A) U2.19(VDD1A) ; port AVDD
DTR: Q17.2(E) R71.2 U6.28(DTR) ; port DTR
EN: C33.2 EN.3(C) Q18.3(C) R81.2 U8.3(EN) ; port EN
ESP_SCL: P15.15 R75.2 U3.14(SCL) U4.14(SCL) U7.6(SCL) U8.9(IO33) ; port ESP_SCL
ESP_SDA: P15.17 R76.2 U3.15(SDA) U4.15(SDA) U7.5(SDA) U8.8(IO32) ; port ESP_SDA
ETH_CRS_DV: R15.1 U8.12(IO27) ; port ETH_CRS_DV
ETH_MDC: U2.13(MDC) U8.37(IO23) ; port ETH_MDC
ETH_MDIO: R4.2 U2.12(MDIO) U8.30(IO18) ; port ETH_MDIO
ETH_REFCLK: R83.2 RN1.1 RN1.2 ; port ETH_REFCLK
ETH_RXD+: R12.1 U8.11(IO26) ; port ETH_RXD+
ETH_RXD-: R14.1 U8.10(IO25) ; port ETH_RXD-
ETH_TXD+: U2.18(TXD1) U8.36(IO22) ; port ETH_TXD+
ETH_TXD-: U2.17(TXD0) U8.31(IO19) ; port ETH_TXD-
ETH_TXDEN: U2.16(TXEN) U8.33(IO21) ; port ETH_TXDEN
GPIO0: BOOT.3(C) Q17.3(C) R82.2 R83.1 U8.25(IO0) ; port GPIO0
GPIO4: DIP1.1 P15.8 R74.1 U8.26(IO4) ; port GPIO4
GPIO5: DIP1.2 P15.10 R77.1 U8.29(IO5) ; port GPIO5
INPUT_0: C8.1 D4.1(C) D6.1 F1.2 R1.2 U4.4(P0) ; port INPUT_0
INPUT_1: C12.1 D9.1 D10.1(C) F2.1 R9.2 U4.5(P1) ; port INPUT_1
INPUT_2: C16.1 D12.1(C) D13.1 F3.2 R16.2 U4.6(P2) ; port INPUT_2
INPUT_3: C18.1 D14.1 D15.1(C) F4.1 R19.2 U4.7(P3) ; port INPUT_3
INPUT_4: C19.1 D16.1(C) D17.1 F5.2 R20.2 U4.9(P4) ; port INPUT_4
INPUT_5: C20.1 D18.1 D19.1(C) F6.1 R21.2 U4.10(P5) ; port INPUT_5
INPUT_6: C21.1 D24.1(C) D25.1 F11.2 R34.2 U4.11(P6) ; port INPUT_6
INPUT_7: C22.1 D26.1 D27.1(C) F12.1 R43.2 U4.12(P7) ; port INPUT_7
INT: R66.2 R67.2 U4.13(INT#) ; port INT
INT_ESP32: DIP1.4 P15.9 U8.16(IO13) ; port INT_ESP32
IO12: P15.5 U8.14(IO12) ; port IO12
IO16: P15.7 U8.27(IO16) ; port IO16
LED_G: R13.2 U2.3(LED1/REGOFF) ; port LED_G
LED_Y: R10.2 U2.2(LED2/nINTSEL) ; port LED_Y
OUT_1: R26.2 R35.2 U3.4(P0) ; port OUT_1
OUT_2: R28.2 R36.2 U3.5(P1) ; port OUT_2
OUT_3: R30.2 R37.2 U3.6(P2) ; port OUT_3
OUT_4: R32.2 R38.2 U3.7(P3) ; port OUT_4
OUT_5: R48.2 R56.2 U3.9(P4) ; port OUT_5
OUT_6: R50.2 R57.2 U3.10(P5) ; port OUT_6
OUT_7: R52.2 R58.2 U3.11(P6) ; port OUT_7
OUT_8: R54.2 R60.2 U3.12(P7) ; port OUT_8
PHY_PWR_ESP32: DIP1.3 P15.11 U8.28(IO17) ; port PHY_PWR_ESP32
PHY_PWR_ETH: DIP1.6 R17.1 ; port PHY_PWR_ETH
RD+: D2.2 R5.2 RJ1.1 U2.23(RXP) ; port RD+
RD-: D1.1 R6.2 RJ1.2 U2.22(RXN) ; port RD-
RTS: Q18.2(E) R68.2 U6.24(RTS) ; port RTS
RXD: H1.4 R69.1 U8.34(RXD0) ; port RXD
TD+: D5.2 R7.2 RJ1.5 U2.21(TXP) ; port TD+
TD-: D3.1 R8.2 RJ1.6 U2.20(TXN) ; port TD-
TXD: H1.5 R70.1 U8.35(TXD0) ; port TXD
USB_DN: D33.2 U6.5(D-) USB1.A7(DN1) USB1.B7(DN2) ; port USB_DN
USB_DP: D32.2 U6.4(D+) USB1.A6(DP1) USB1.B6(DP2) ; port USB_DP
USB_RX: R69.2 U6.26(TXD) ; port USB_RX
USB_TX: R70.2 U6.25(RXD) ; port USB_TX
USB_VBUS: R78.1 USB1.A4(VBUS) USB1.A9(VBUS) USB1.B4(VBUS) USB1.B9(VBUS) ; port USB_VBUS
NetBT1_1: BT1.1 U7.3(VBAT)
NetC9_1: C9.1 C10.1 U2.6(VDDCR)
NetC14_1: C14.1 R2.2 U2.15(nRST)
NetC24_1: C24.1 USB1.1(EP) USB1.2(EP) USB1.3(EP) USB1.4(EP)
NetC28_1: C28.1 U5.1(OUT) U7.8(VCC)
NetD11_1: D11.1 RJ1.9 U1.1(VA1) U1.3(VB1)
NetD11_2: D11.2 RJ1.10 U1.2(VA2) U1.4(VB2)
NetD20_1: D20.1(-) F7.2 RELAY1.4
NetD20_2: D20.2(+) Q1.3(D) R22.2 RELAY1.1
NetD21_1: D21.1(-) F8.2 RELAY2.4
NetD21_2: D21.2(+) Q2.3(D) R23.2 RELAY2.1
NetD22_1: D22.1(-) F9.2 RELAY3.4
NetD22_2: D22.2(+) Q3.3(D) R24.2 RELAY3.1
NetD23_1: D23.1(-) F10.2 RELAY4.4
NetD23_2: D23.2(+) Q4.3(D) R25.2 RELAY4.1
NetD28_1: D28.1(-) F13.2 RELAY5.4
NetD28_2: D28.2(+) Q9.3(D) R44.2 RELAY5.1
NetD29_1: D29.1(-) F14.2 RELAY6.4
NetD29_2: D29.2(+) Q10.3(D) R45.2 RELAY6.1
NetD30_1: D30.1(-) F15.2 RELAY7.4
NetD30_2: D30.2(+) Q11.3(D) R46.2 RELAY7.1
NetD31_1: D31.1(-) F16.2 RELAY8.4
NetD31_2: D31.2(+) Q12.3(D) R47.2 RELAY8.1
NetD35_1: D35.1 D37.1(C) F18.1 R74.2
NetD36_1: D36.1 D38.1(C) F19.1 R77.2
NetD39_2: D39.2 D40.1(C) R78.2 R79.1 U6.8(VBUS)
NetD41_1: D41.1(K) D42.1(K) F20.1
NetD42_2: D42.2(A) D44.2(A) D46.1 P16.2
NetD47_1: D47.1(-) L2.1 U9.2(Output)
NetDIP1_5: DIP1.5 R67.1
NetDIP1_7: DIP1.7 R65.2
NetDIP1_8: DIP1.8 R64.2
NetF1_1: F1.1 P1.1
NetF2_2: F2.2 P1.3
NetF3_1: F3.1 P2.1
NetF4_2: F4.2 P2.3
NetF5_1: F5.1 P3.1
NetF6_2: F6.2 P3.3
NetF11_1: F11.1 P8.1
NetF12_2: F12.2 P8.3
NetF17_1: F17.1 P13.2
NetF18_2: F18.2 P14.1
NetF19_2: F19.2 P14.2
NetLED1_2: LED1.2(K) R22.1
NetLED2_2: LED2.2(K) R23.1
NetLED3_2: LED3.2(K) R24.1
NetLED4_2: LED4.2(K) R25.1
NetLED5_2: LED5.2(K) R44.1
NetLED6_2: LED6.2(K) R45.1
NetLED7_2: LED7.2(K) R46.1
NetLED8_2: LED8.2(K) R47.1
NetLED9_2: LED9.2(K) R87.1
NetLED10_1: LED10.1(A) R86.2
NetLED10_2: LED10.2(K) Q19.3(D)
NetP4_1: P4.1 RELAY1.2
NetP4_2: P4.2 RELAY1.5
NetP4_3: P4.3 RELAY1.3
NetP5_1: P5.1 RELAY2.2
NetP5_2: P5.2 RELAY2.5
NetP5_3: P5.3 RELAY2.3
NetP6_1: P6.1 RELAY3.2
NetP6_2: P6.2 RELAY3.5
NetP6_3: P6.3 RELAY3.3
NetP7_1: P7.1 RELAY4.2
NetP7_2: P7.2 RELAY4.5
NetP7_3: P7.3 RELAY4.3
NetP9_1: P9.1 RELAY5.2
NetP9_2: P9.2 RELAY5.5
NetP9_3: P9.3 RELAY5.3
NetP10_1: P10.1 RELAY6.2
NetP10_2: P10.2 RELAY6.5
NetP10_3: P10.3 RELAY6.3
NetP11_1: P11.1 RELAY7.2
NetP11_2: P11.2 RELAY7.5
NetP11_3: P11.3 RELAY7.3
NetP12_1: P12.1 RELAY8.2
NetP12_2: P12.2 RELAY8.5
NetP12_3: P12.3 RELAY8.3
NetQ1_1: Q1.1(G) Q5.3(C) R27.2 R39.1
NetQ2_1: Q2.1(G) Q6.3(C) R29.2 R40.1
NetQ3_1: Q3.1(G) Q7.3(C) R31.2 R41.1
NetQ4_1: Q4.1(G) Q8.3(C) R33.2 R42.1
NetQ5_1: Q5.1(B) R35.1
NetQ6_1: Q6.1(B) R36.1
NetQ7_1: Q7.1(B) R37.1
NetQ8_1: Q8.1(B) R38.1
NetQ9_1: Q9.1(G) Q13.3(C) R49.2 R62.1
NetQ10_1: Q10.1(G) Q14.3(C) R51.2 R63.1
NetQ11_1: Q11.1(G) Q15.3(C) R53.2 R59.1
NetQ12_1: Q12.1(G) Q16.3(C) R55.2 R61.1
NetQ13_1: Q13.1(B) R56.1
NetQ14_1: Q14.1(B) R57.1
NetQ15_1: Q15.1(B) R58.1
NetQ16_1: Q16.1(B) R60.1
NetQ17_1: Q17.1(B) R68.1
NetQ18_1: Q18.1(B) R71.1
NetQ19_1: Q19.1(G) R85.2
NetR3_2: R3.2 U2.10(RXER/PHYAD0)
NetR10_1: R10.1 RJ1.12
NetR11_1: R11.1 U2.24(RBIAS)
NetR12_2: R12.2 U2.7(RXD1/MODE1)
NetR13_1: R13.1 RJ1.14
NetR14_2: R14.2 U2.8(RXD0/MODE0)
NetR15_2: R15.2 U2.11(CRS_DV/MODE2)
NetR17_2: R17.2 R18.1 X1.1(Enable/Disable)
NetR72_1: R72.1 USB1.A5(CC1)
NetR73_1: R73.1 USB1.B5(CC2)
NetR80_1: R80.1 U6.9(RST#)
NetR84_1: R84.1 R85.1 U8.13(IO14)
NetRN1_3: RN1.3 U2.5(XTAL1/CLKIN)
NetRN1_6: RN1.6 RN1.7 X1.3(OUT)
NetRN1_8: RN1.8 U2.14(nINT/REFCLKO)
NetU7_1: U7.1(X1) X2.1(OSC1)
NetU7_2: U7.2(X2) X2.2(OSC2)

Not connected (* = marked no-connect by the designer): BOOT 1(A)* 4(D)*; EN 1(A)* 4(D)*; H1 2* 3* 6*; RF1 1(SIG); RJ1 7* 8*; RN1 4* 5*; U1 5(AT/DET+)* 6(GND)*; U2 4(XTAL2)*; U3 13(INT#)*; U6 1(DCD)* 2(RI)* 10(NC)* 11(SUSPEND#)* 12(SUSPEND)* 13(NC)* 14(NC)* 15(NC)* 16(NC)* 17(NC)* 18(NC)* 19(NC)* 20(NC)* 21(NC)* 22(NC)* 23(CTS)* 27(DSR)*; U7 7(SQW/OUT)*; U8 4(SENSOR_VP)* 5(SENSOR_VN)* 6(IO34)* 7(IO35)* 17(SD2)* 18(SD3)* 19(CMD)* 20(CLK)* 21(SD0)* 22(SD1)* 23(IO15)* 24(IO2)* 32(NC)*; USB1 A8(SUB1)* B8(SUB2)*

## Notes on the sheet
- RJ45/PoE
- Ethernet
- IO Expander (Outputs)
- Input Protection
- Relays
- Configuration Switches
- RF Connector
- IO Expander (Inputs)
- USB
- Real Time Clock
- Expansion
- Aux Power Output
- EN
- 12VDC IN
- (near BOOT) BOOT
- STATUS LED
- ESP32-WROOM-32
- Power Management
- Creative Commons
- CC BY-SA 4.0
- (in symbol HY931147C) 1CT:1; J8; J7; J6/R-; J5; J4; J3/R+; J2/T-; J1/T+; Yellow; Green

## Library data of the parts
BOOT EN = TS-1187A-B-A-B: BOM_Manufacturer: XKB Enterprise; Contributor: LCSC; Package Display: No; BOM_Supplier: LCSC; BOM_Supplier Part: C318884; BOM_Manufacturer Part: TS-1187A-B-A-B; BOM_JLCPCB Part Class: Basic Part; spicePre: S; spiceSymbolName: TS-1187A-B-A-B
BT1 = BS-12-A1AJ002-F: BOM_Manufacturer: MYOUNG(美阳); Contributor: LCSC; BOM_Supplier: LCSC; BOM_Supplier Part: C964720; BOM_Manufacturer Part: BS-12-A1AJ002-F; BOM_JLCPCB Part Class: Extended Part; spicePre: B; spiceSymbolName: BS-12-A1AJ002-F
C1 C14 C15 C17 C23 C25-C28 C30 C31 C37 = 100nF: BOM_Manufacturer Part: CL05B104KO5NNNC; BOM_Manufacturer: SAMSUNG; nameAlias: Capacitance; BOM_Supplier: LCSC; BOM_Supplier Part: C1525; BOM_JLCPCB Part Class: Basic Part; spicePre: C; spiceSymbolName: CL05B104KO5NNNC
C2 C5 C7 C8 C11 C12 C16 C18-C22 C32 = 10nF: BOM_Manufacturer Part: CL05B103KB5NNNC; BOM_Manufacturer: SAMSUNG; nameAlias: Capacitance; BOM_Supplier: LCSC; BOM_Supplier Part: C15195; BOM_JLCPCB Part Class: Basic Part; spicePre: C; spiceSymbolName: CL05B103KB5NNNC
C3 C4 C34 C35 = 22uF: BOM_Manufacturer: BERYL(绿宝石); BOM_Manufacturer Part: CN035M220LO5*11L-1A4T; nameAlias: Capacitance; Contributor: LCSC; BOM_Supplier: LCSC; BOM_Supplier Part: C512951; BOM_JLCPCB Part Class: Extended Part; spicePre: C; spiceSymbolName: CN035M220LO5*11L-1A4T
C6 = 22nF: BOM_Manufacturer: FH; BOM_Manufacturer Part: 0402B223K500NT; nameAlias: Capacitance; BOM_Supplier: LCSC; BOM_Supplier Part: C1532; BOM_JLCPCB Part Class: Basic Part; spicePre: C; spiceSymbolName: 0402B223K500NT
C9 = 1uF: BOM_Manufacturer Part: CL10A105KB8NNNC; BOM_Manufacturer: SAMSUNG; nameAlias: Capacitance; BOM_Supplier: LCSC; BOM_Supplier Part: C15849; BOM_JLCPCB Part Class: Basic Part; spicePre: C; spiceSymbolName: CL10A105KB8NNNC
C10 = 330pF: BOM_Manufacturer Part: CL05C331JB5NNNC; BOM_Manufacturer: SAMSUNG; nameAlias: Capacitance; BOM_Supplier: LCSC; BOM_Supplier Part: C13533; BOM_JLCPCB Part Class: Basic Part; spicePre: C; spiceSymbolName: CL05C331JB5NNNC
C13 C24 = 1nF: BOM_Manufacturer: FH; BOM_Manufacturer Part: 1206B102K202NT; nameAlias: Capacitance; BOM_Supplier: LCSC; BOM_Supplier Part: C9196; BOM_JLCPCB Part Class: Extended Part; spicePre: C; spiceSymbolName: 1206B102K202NT
C29 C33 = 4.7uF: BOM_Manufacturer: FH; BOM_Manufacturer Part: 1206B475K500NT; nameAlias: Capacitance; BOM_Supplier: LCSC; BOM_Supplier Part: C29823; BOM_JLCPCB Part Class: Basic Part; spicePre: C; spiceSymbolName: 1206B475K500NT
C36 = 10nF: BOM_Manufacturer Part: CL21B103KBANNNC; BOM_Manufacturer: SAMSUNG; nameAlias: Capacitance; BOM_Supplier: LCSC; BOM_Supplier Part: C1710; BOM_JLCPCB Part Class: Basic Part; spicePre: C; spiceSymbolName: CL21B103KBANNNC
D1-D3 D5-D7 D9 D13 D14 D17 D18 D25 D26 D32 D33 D35 D36 D39 = PESD03V32D-LC: BOM_Manufacturer: TECH PUBLIC(台舟); Contributor: LCSC; BOM_Supplier: LCSC; BOM_Supplier Part: C2912528; BOM_Manufacturer Part: PESD03V32D-LC; BOM_JLCPCB Part Class: Extended Part; spicePre: D; spiceSymbolName: PESD03V32D-LC
D4 D10 D12 D15 D16 D19 D24 D27 D37 D38 D40 = ZMM3V3: BOM_Manufacturer: SEMTECH; BOM_Supplier: LCSC; BOM_Manufacturer Part: ZMM3V3; BOM_Supplier Part: C8056; BOM_JLCPCB Part Class: Basic Part; spicePre: D; spiceSymbolName: ZMM3V3
D8 D34 = SMBJ14CA_C397712: BOM_Manufacturer: AnBon; Contributor: LCSC; Package Display: No; BOM_Supplier: LCSC; BOM_Supplier Part: C397712; BOM_Manufacturer Part: SMBJ14CA; BOM_JLCPCB Part Class: Extended Part; spicePre: D; spiceSymbolName: SMBJ14CA_C397712
D11 = SMBJ64CA: BOM_Manufacturer: Brightking Elec (TAIWAN); Contributor: LCSC; BOM_Supplier: LCSC; BOM_Supplier Part: C123975; BOM_Manufacturer Part: SMBJ64CA; BOM_JLCPCB Part Class: Extended Part; spicePre: D; spiceSymbolName: SMBJ64CA_C123975
D20-D23 D28-D31 = B5819W_C8598: BOM_Manufacturer: CJ; BOM_Manufacturer Part: B5819W; Package Display: No; BOM_Supplier: LCSC; BOM_Supplier Part: C8598; BOM_JLCPCB Part Class: Basic Part; spicePre: D; spiceSymbolName: B5819W_C8598
D41-D44 = SS34_C8678: BOM_Manufacturer Part: SS34; BOM_Manufacturer: MDD; BOM_Supplier: LCSC; BOM_Supplier Part: C8678; BOM_JLCPCB Part Class: Basic Part; spicePre: D; spiceSymbolName: SS34_C8678
D45 = 2EZ13D5_C388131: BOM_Manufacturer: SUNMATE Elec; Contributor: LCSC; BOM_Supplier: LCSC; BOM_Supplier Part: C388131; BOM_Manufacturer Part: 2EZ13D5; BOM_JLCPCB Part Class: Extended Part; spicePre: D; spiceSymbolName: 2EZ13D5_C388131
D46 = SMBJ14CA_C397712: BOM_Manufacturer: AnBon; Contributor: LCSC; BOM_Supplier: LCSC; BOM_Supplier Part: C397712; BOM_Manufacturer Part: SMBJ14CA; BOM_JLCPCB Part Class: Extended Part; spicePre: D; spiceSymbolName: SMBJ14CA_C397712
D47 = B5819W_C8598: BOM_Manufacturer: CJ; BOM_Manufacturer Part: B5819W; BOM_Supplier: LCSC; BOM_Supplier Part: C8598; BOM_JLCPCB Part Class: Basic Part; spicePre: D; spiceSymbolName: B5819W_C8598
DIP1 = DSIC04LHGET: BOM_Manufacturer: YE; Package Display: No; BOM_Supplier: LCSC; BOM_Manufacturer Part: DSIC04LHGET; BOM_Supplier Part: C54959; BOM_JLCPCB Part Class: Extended Part; spicePre: D; spiceSymbolName: DSIC04LHGET
F1-F6 F11 F12 F18 F19 = BSMD0603-002-60V: BOM_Manufacturer: BHFUSE; Contributor: LCSC; Package Display: No; BOM_Supplier: LCSC; BOM_Supplier Part: C914089; BOM_Manufacturer Part: BSMD0603-002-60V; BOM_JLCPCB Part Class: Extended Part; spicePre: F; spiceSymbolName: BSMD0603-002-60V
F7-F10 F13-F16 = BSMD0603-025-16V: BOM_Manufacturer: BHFUSE; Contributor: LCSC; BOM_Supplier: LCSC; BOM_Supplier Part: C883094; BOM_Manufacturer Part: BSMD0603-025-16V; BOM_JLCPCB Part Class: Extended Part; spicePre: F; spiceSymbolName: BSMD0603-025-16V
F17 = ASMD2920-075: BOM_Manufacturer: JDTFUSE; Contributor: LCSC; Package Display: No; BOM_Supplier: LCSC; BOM_Manufacturer Part: ASMD2920-075; BOM_Supplier Part: C135375; BOM_JLCPCB Part Class: Extended Part; spicePre: F; spiceSymbolName: ASMD2920-075
F20 = SMD1812P150TF/24: BOM_Manufacturer: RUILON(瑞隆源); BOM_Supplier: LCSC; BOM_Manufacturer Part: SMD1812P150TF/24; BOM_Supplier Part: C32404; BOM_JLCPCB Part Class: Extended Part; spicePre: F; spiceSymbolName: SMD1812P150TF/24
H1 = PZ254-1-06-Z-8.5: BOM_Manufacturer: HCTL(华灿天禄); Contributor: LCSC; Package Display: No; BOM_Supplier: LCSC; BOM_Supplier Part: C2894929; BOM_Manufacturer Part: PZ254-1-06-Z-8.5; BOM_JLCPCB Part Class: Extended Part; spicePre: H; spiceSymbolName: PZ254-1-06-Z-8.5
L1 = 30R: BOM_Manufacturer: Sunltech Tech; BOM_Manufacturer Part: SBM2012G300LSP; Contributor: LCSC; BOM_Supplier: LCSC; BOM_Supplier Part: C216133; BOM_JLCPCB Part Class: Extended Part; spicePre: L; spiceSymbolName: SBM2012G300LSP
L2 = 33uH: BOM_Manufacturer: FH; BOM_Manufacturer Part: VLU0810-330K; nameAlias: Inductance; BOM_Supplier: LCSC; BOM_Supplier Part: C72622; BOM_JLCPCB Part Class: Extended Part; spicePre: L; spiceSymbolName: VLU0810-330K
LED1-LED10 = 0603White light_C2290: BOM_Manufacturer: KENTO; BOM_Manufacturer Part: KT-0603白灯; Package Display: No; BOM_Supplier: LCSC; BOM_Supplier Part: C2290; BOM_JLCPCB Part Class: Basic Part; spicePre: L; spiceSymbolName: 0603White light_C2290
P1-P12 = WJ127-5.0-3P: BOM_Manufacturer: ReliaPro; BOM_Supplier: LCSC; BOM_Manufacturer Part: WJ127-5.0-3P; BOM_Supplier Part: C8393; BOM_JLCPCB Part Class: Extended Part; spicePre: P; spiceSymbolName: WJ127-5.0-3P
P13 P16 = WJ127-5.0-2P: BOM_Manufacturer: ReliaPro; BOM_Supplier: LCSC; BOM_Manufacturer Part: WJ127-5.0-2P; BOM_Supplier Part: C3703; BOM_JLCPCB Part Class: Extended Part; spicePre: P; spiceSymbolName: WJ127-5.0-2P
P14 = WJ127-5.0-2P: BOM_Manufacturer: ReliaPro; Package Display: No; BOM_Supplier: LCSC; BOM_Manufacturer Part: WJ127-5.0-2P; BOM_Supplier Part: C3703; BOM_JLCPCB Part Class: Extended Part; spicePre: P; spiceSymbolName: WJ127-5.0-2P
P15 = Header-Female-2.54_2x10: BOM_Manufacturer: BOOMELE; BOM_Manufacturer Part: 2.54mm,2×10Double row female; BOM_Supplier: LCSC; BOM_Supplier Part: C30867; BOM_JLCPCB Part Class: Extended Part; spicePre: P; spiceSymbolName: Header-Female-2.54_2x10
Q1-Q4 Q9-Q12 = AO3400A: BOM_Manufacturer: AOS; BOM_Supplier: LCSC; BOM_Manufacturer Part: AO3400A; BOM_Supplier Part: C20917; BOM_JLCPCB Part Class: Basic Part; spicePre: Q; spiceSymbolName: AO3400A
Q5-Q8 Q13-Q16 = 2N3904: BOM_Manufacturer: CJ; BOM_Manufacturer Part: MMBT3904; Contributor: 立创EDA官方封装库; Package Display: No; BOM_Supplier: LCSC; BOM_Supplier Part: C20526; BOM_JLCPCB Part Class: Basic Part; spicePre: Q; spiceSymbolName: MMBT3904-C20526
Q17 Q18 = MMBT2222A_C8512: BOM_Manufacturer: CJ; BOM_Supplier: LCSC; BOM_Manufacturer Part: MMBT2222A; BOM_Supplier Part: C8512; BOM_JLCPCB Part Class: Basic Part; spicePre: Q; spiceSymbolName: MMBT2222A_C8512
Q19 = 2N7002: BOM_Manufacturer: CJ; BOM_Supplier: LCSC; BOM_Manufacturer Part: 2N7002; BOM_Supplier Part: C8545; BOM_JLCPCB Part Class: Basic Part; spicePre: Q; spiceSymbolName: 2N7002
R1 R9 R16 R19-R21 R34 R39-R43 R59 R61-R63 = 100K: BOM_Manufacturer: UniOhm; BOM_Manufacturer Part: 0402WGF1003TCE; nameAlias: Resistance (Ohms); BOM_Supplier: LCSC; BOM_Supplier Part: C25741; BOM_JLCPCB Part Class: Basic Part; spicePre: R; spiceSymbolName: 0402WGF1003TCE
R2 R27 R29 R31 R33 R49 R51 R53 R55 R64-R66 R75 R76 = 4.7K: BOM_Manufacturer: UniOhm; BOM_Manufacturer Part: 0402WGF4701TCE; nameAlias: Resistance (Ohms); BOM_Supplier: LCSC; BOM_Supplier Part: C25900; BOM_JLCPCB Part Class: Basic Part; spicePre: R; spiceSymbolName: 0402WGF4701TCE
R3 R12 R14 R15 = 10: BOM_Manufacturer: UniOhm; BOM_Manufacturer Part: 0402WGF100JTCE; nameAlias: Resistance (Ohms); BOM_Supplier: LCSC; BOM_Supplier Part: C25077; BOM_JLCPCB Part Class: Basic Part; spicePre: R; spiceSymbolName: 0402WGF100JTCE
R4 = 1.5K: BOM_Manufacturer: UniOhm; BOM_Manufacturer Part: 0402WGF1501TCE; nameAlias: Resistance (Ohms); BOM_Supplier: LCSC; BOM_Supplier Part: C25867; BOM_JLCPCB Part Class: Basic Part; spicePre: R; spiceSymbolName: 0402WGF1501TCE
R5-R8 = 49.9: BOM_Manufacturer: UniOhm; BOM_Manufacturer Part: 0402WGF499JTCE; nameAlias: Resistance (Ohms); BOM_Supplier: LCSC; BOM_Supplier Part: C25120; BOM_JLCPCB Part Class: Basic Part; spicePre: R; spiceSymbolName: 0402WGF499JTCE
R10 R13 = 330: BOM_Manufacturer: UniOhm; BOM_Manufacturer Part: 0402WGF3300TCE; nameAlias: Resistance (Ohms); BOM_Supplier: LCSC; BOM_Supplier Part: C25104; BOM_JLCPCB Part Class: Basic Part; spicePre: R; spiceSymbolName: 0402WGF3300TCE
R11 R81 R82 = 12.1K: BOM_Manufacturer: UniOhm; BOM_Manufacturer Part: 0402WGF1212TCE; nameAlias: Resistance (Ohms); BOM_Supplier: LCSC; BOM_Supplier Part: C25852; BOM_JLCPCB Part Class: Extended Part; spicePre: R; spiceSymbolName: 0402WGF1212TCE
R17 R67 R74 R77 R83 = 470: BOM_Manufacturer: UniOhm; BOM_Manufacturer Part: 0402WGF4700TCE; nameAlias: Resistance (Ohms); BOM_Supplier: LCSC; BOM_Supplier Part: C25117; BOM_JLCPCB Part Class: Basic Part; spicePre: R; spiceSymbolName: 0402WGF4700TCE
R18 R68 R71 R84 = 10K: BOM_Manufacturer: UniOhm; BOM_Manufacturer Part: 0402WGF1002TCE; nameAlias: Resistance (Ohms); BOM_Supplier: LCSC; BOM_Supplier Part: C25744; BOM_JLCPCB Part Class: Basic Part; spicePre: R; spiceSymbolName: 0402WGF1002TCE
R22-R25 R44-R47 R86 R87 = 2.2kΩ: BOM_Manufacturer: UNI-ROYAL(厚声); BOM_Manufacturer Part: 0603WAF2201T5E; nameAlias: Resistance; Resistance (Ohms): 2.2K; BOM_Supplier: LCSC; BOM_Supplier Part: C4190; BOM_JLCPCB Part Class: Basic Part; spicePre: R; spiceSymbolName: 0603WAF2201T5E
R26 R28 R30 R32 R48 R50 R52 R54 = 2.2kΩ: BOM_Manufacturer: UniOhm; BOM_Manufacturer Part: 0402WGF2201TCE; nameAlias: Resistance; Resistance (Ohms): 2.2K; BOM_Supplier: LCSC; BOM_Supplier Part: C25879; BOM_JLCPCB Part Class: Basic Part; spicePre: R; spiceSymbolName: 0402WGF2201TCE
R35-R38 R56-R58 R60 R85 = 510Ω: BOM_Manufacturer: UniOhm; BOM_Manufacturer Part: 0402WGF5100TCE; nameAlias: Resistance; Resistance (Ohms): 510; BOM_Supplier: LCSC; BOM_Supplier Part: C25123; BOM_JLCPCB Part Class: Basic Part; spicePre: R; spiceSymbolName: 0402WGF5100TCE
R69 R70 = 680Ω: BOM_Manufacturer: UNI-ROYAL(厚声); BOM_Manufacturer Part: 0402WGF6800TCE; nameAlias: Resistance; Resistance (Ohms): 680; BOM_Supplier: LCSC; BOM_Supplier Part: C25130; BOM_JLCPCB Part Class: Basic Part; spicePre: R; spiceSymbolName: 0402WGF6800TCE
R72 R73 = 5.1K: BOM_Manufacturer: YAGEO(国巨); BOM_Manufacturer Part: RC0402FR-075K1L; nameAlias: Resistance (Ohms); Resistance: 5.1kΩ; BOM_Supplier: LCSC; BOM_Supplier Part: C105872; BOM_JLCPCB Part Class: Extended Part; spicePre: R; spiceSymbolName: RC0402FR-075K1L
R78 = 24kΩ: BOM_Manufacturer: UNI-ROYAL(厚声); BOM_Manufacturer Part: 0402WGF2402TCE; nameAlias: Resistance; Resistance (Ohms): 24K; BOM_Supplier: LCSC; BOM_Supplier Part: C25769; BOM_JLCPCB Part Class: Basic Part; spicePre: R; spiceSymbolName: 0402WGF2402TCE
R79 = 49.9kΩ: BOM_Manufacturer: UNI-ROYAL(厚声); BOM_Manufacturer Part: 0402WGF4992TCE; nameAlias: Resistance; Resistance (Ohms): 49.9K; BOM_Supplier: LCSC; BOM_Supplier Part: C25897; BOM_JLCPCB Part Class: Basic Part; spicePre: R; spiceSymbolName: 0402WGF4992TCE
R80 = 2kΩ: BOM_Manufacturer Part: 0402WGF2001TCE; BOM_Manufacturer: UNI-ROYAL(厚声); nameAlias: Resistance; Resistance (Ohms): 2K; BOM_Supplier: LCSC; BOM_Supplier Part: C4109; BOM_JLCPCB Part Class: Basic Part; spicePre: R; spiceSymbolName: 0402WGF2001TCE
RELAY1-RELAY8 = SRD-12VDC-SL-C: BOM_Manufacturer: SONGLE; Package Display: No; BOM_Supplier: LCSC; BOM_Manufacturer Part: SRD-12VDC-SL-C; BOM_Supplier Part: C30431; BOM_JLCPCB Part Class: Extended Part; spicePre: R; spiceSymbolName: SRD-12VDC-SL-C
RF1 = SMA: BOM_Manufacturer: 皇捷; BOM_Manufacturer Part: HJ-SMA200; Contributor: LCSC; BOM_Supplier: LCSC; BOM_Supplier Part: C1509215; BOM_JLCPCB Part Class: Extended Part; spicePre: R; spiceSymbolName: HJ-SMA200
RJ1 = HY931147C: BOM_Manufacturer: HANRUN; BOM_Supplier: LCSC; BOM_Manufacturer Part: HY931147C; BOM_Supplier Part: C91754; BOM_JLCPCB Part Class: Extended Part; spicePre: R; spiceSymbolName: HY931147C
RN1 = 33: BOM_Manufacturer: UniOhm; BOM_Manufacturer Part: 4D02WGJ0330TCE; nameAlias: Resistance (Ohms); BOM_Supplier: LCSC; BOM_Supplier Part: C25501; BOM_JLCPCB Part Class: Basic Part; spicePre: R; spiceSymbolName: 4D02WGJ0330TCE
U1 = BPI7402: Contributor: dirtypolecat; spicePre: U; spiceSymbolName: BPI7402
U2 = LAN8720AI-CP-TR: BOM_Manufacturer: SMSC; BOM_Supplier: LCSC; BOM_Manufacturer Part: LAN8720AI-CP-TR; BOM_Supplier Part: C17146; BOM_JLCPCB Part Class: Extended Part; spicePre: U; spiceSymbolName: LAN8720AI-CP-TR
U3 U4 = PCF8574T/3,518: BOM_Manufacturer: NXP(恩智浦); BOM_Supplier: LCSC; BOM_Manufacturer Part: PCF8574T/3,518; BOM_Supplier Part: C7605; BOM_JLCPCB Part Class: Extended Part; spicePre: U; spiceSymbolName: PCF8574T/3,518
U5 = 78L05G-AB3-R: BOM_Manufacturer: UTC; BOM_Supplier: LCSC; BOM_Manufacturer Part: 78L05G-AB3-R; BOM_Supplier Part: C71136; BOM_JLCPCB Part Class: Basic Part; spicePre: U; spiceSymbolName: 78L05G-AB3-R
U6 = CP2102-GMR: BOM_Manufacturer: SILICON LABS(芯科); BOM_Supplier: LCSC; BOM_Manufacturer Part: CP2102-GMR; BOM_Supplier Part: C6568; BOM_JLCPCB Part Class: Basic Part; spicePre: U; spiceSymbolName: CP2102-GMR
U7 = DS1307ZN+: BOM_Manufacturer: MAXIM; spicePre: X; BOM_Supplier: LCSC; BOM_Manufacturer Part: DS1307ZN+; BOM_Supplier Part: C26858; BOM_JLCPCB Part Class: Extended Part; spiceSymbolName: DS1307ZN+
U8 = ESP32-WROOM-32U-N16: BOM_Manufacturer: Espressif Systems; Contributor: LCSC; Package Display: No; BOM_Supplier: LCSC; BOM_Supplier Part: C529580; BOM_Manufacturer Part: ESP32-WROOM-32U-N16; BOM_JLCPCB Part Class: Extended Part; spicePre: U; spiceSymbolName: ESP32-WROOM-32U
U9 = LM2596S-3.3: BOM_Manufacturer: UMW(Youtai Semiconductor Co., Ltd.); Contributor: LCSC; BOM_Paste Type: Extended Part; BOM_Supplier: LCSC; BOM_Supplier Part: C347420; BOM_Manufacturer Part: LM2596S-3.3; JLCPCB Part Class: Extended Part; spicePre: U; spiceSymbolName: LM2596S-3.3
USB1 = KH-TYPE-C-16P: BOM_Manufacturer: kinghelm(金航标); Contributor: LCSC; BOM_Supplier: LCSC; BOM_Supplier Part: C709357; BOM_Manufacturer Part: KH-TYPE-C-16P; BOM_JLCPCB Part Class: Extended Part; spicePre: U; spiceSymbolName: KH-TYPE-C-16P
X1 = 50MHz: BOM_Manufacturer: Yangxing Tech; BOM_Manufacturer Part: OT705050MJBA4SL; nameAlias: Frequency; Contributor: LCSC; BOM_Supplier: LCSC; BOM_Supplier Part: C669094; BOM_JLCPCB Part Class: Extended Part; spicePre: X; spiceSymbolName: OT705050MJBA4SL
X2 = 32.768KHz: BOM_Manufacturer: Zhejiang Abel Elec; nameAlias: Frequency; Contributor: LCSC; BOM_Supplier: LCSC; BOM_Supplier Part: C145164; BOM_Manufacturer Part: -; BOM_JLCPCB Part Class: Extended Part; spicePre: X; spiceSymbolName: TDXLF-308 32.768KHZ 12.5PF 20PPM